# Altium project PnP.PrjPcb (part 1 of 2)
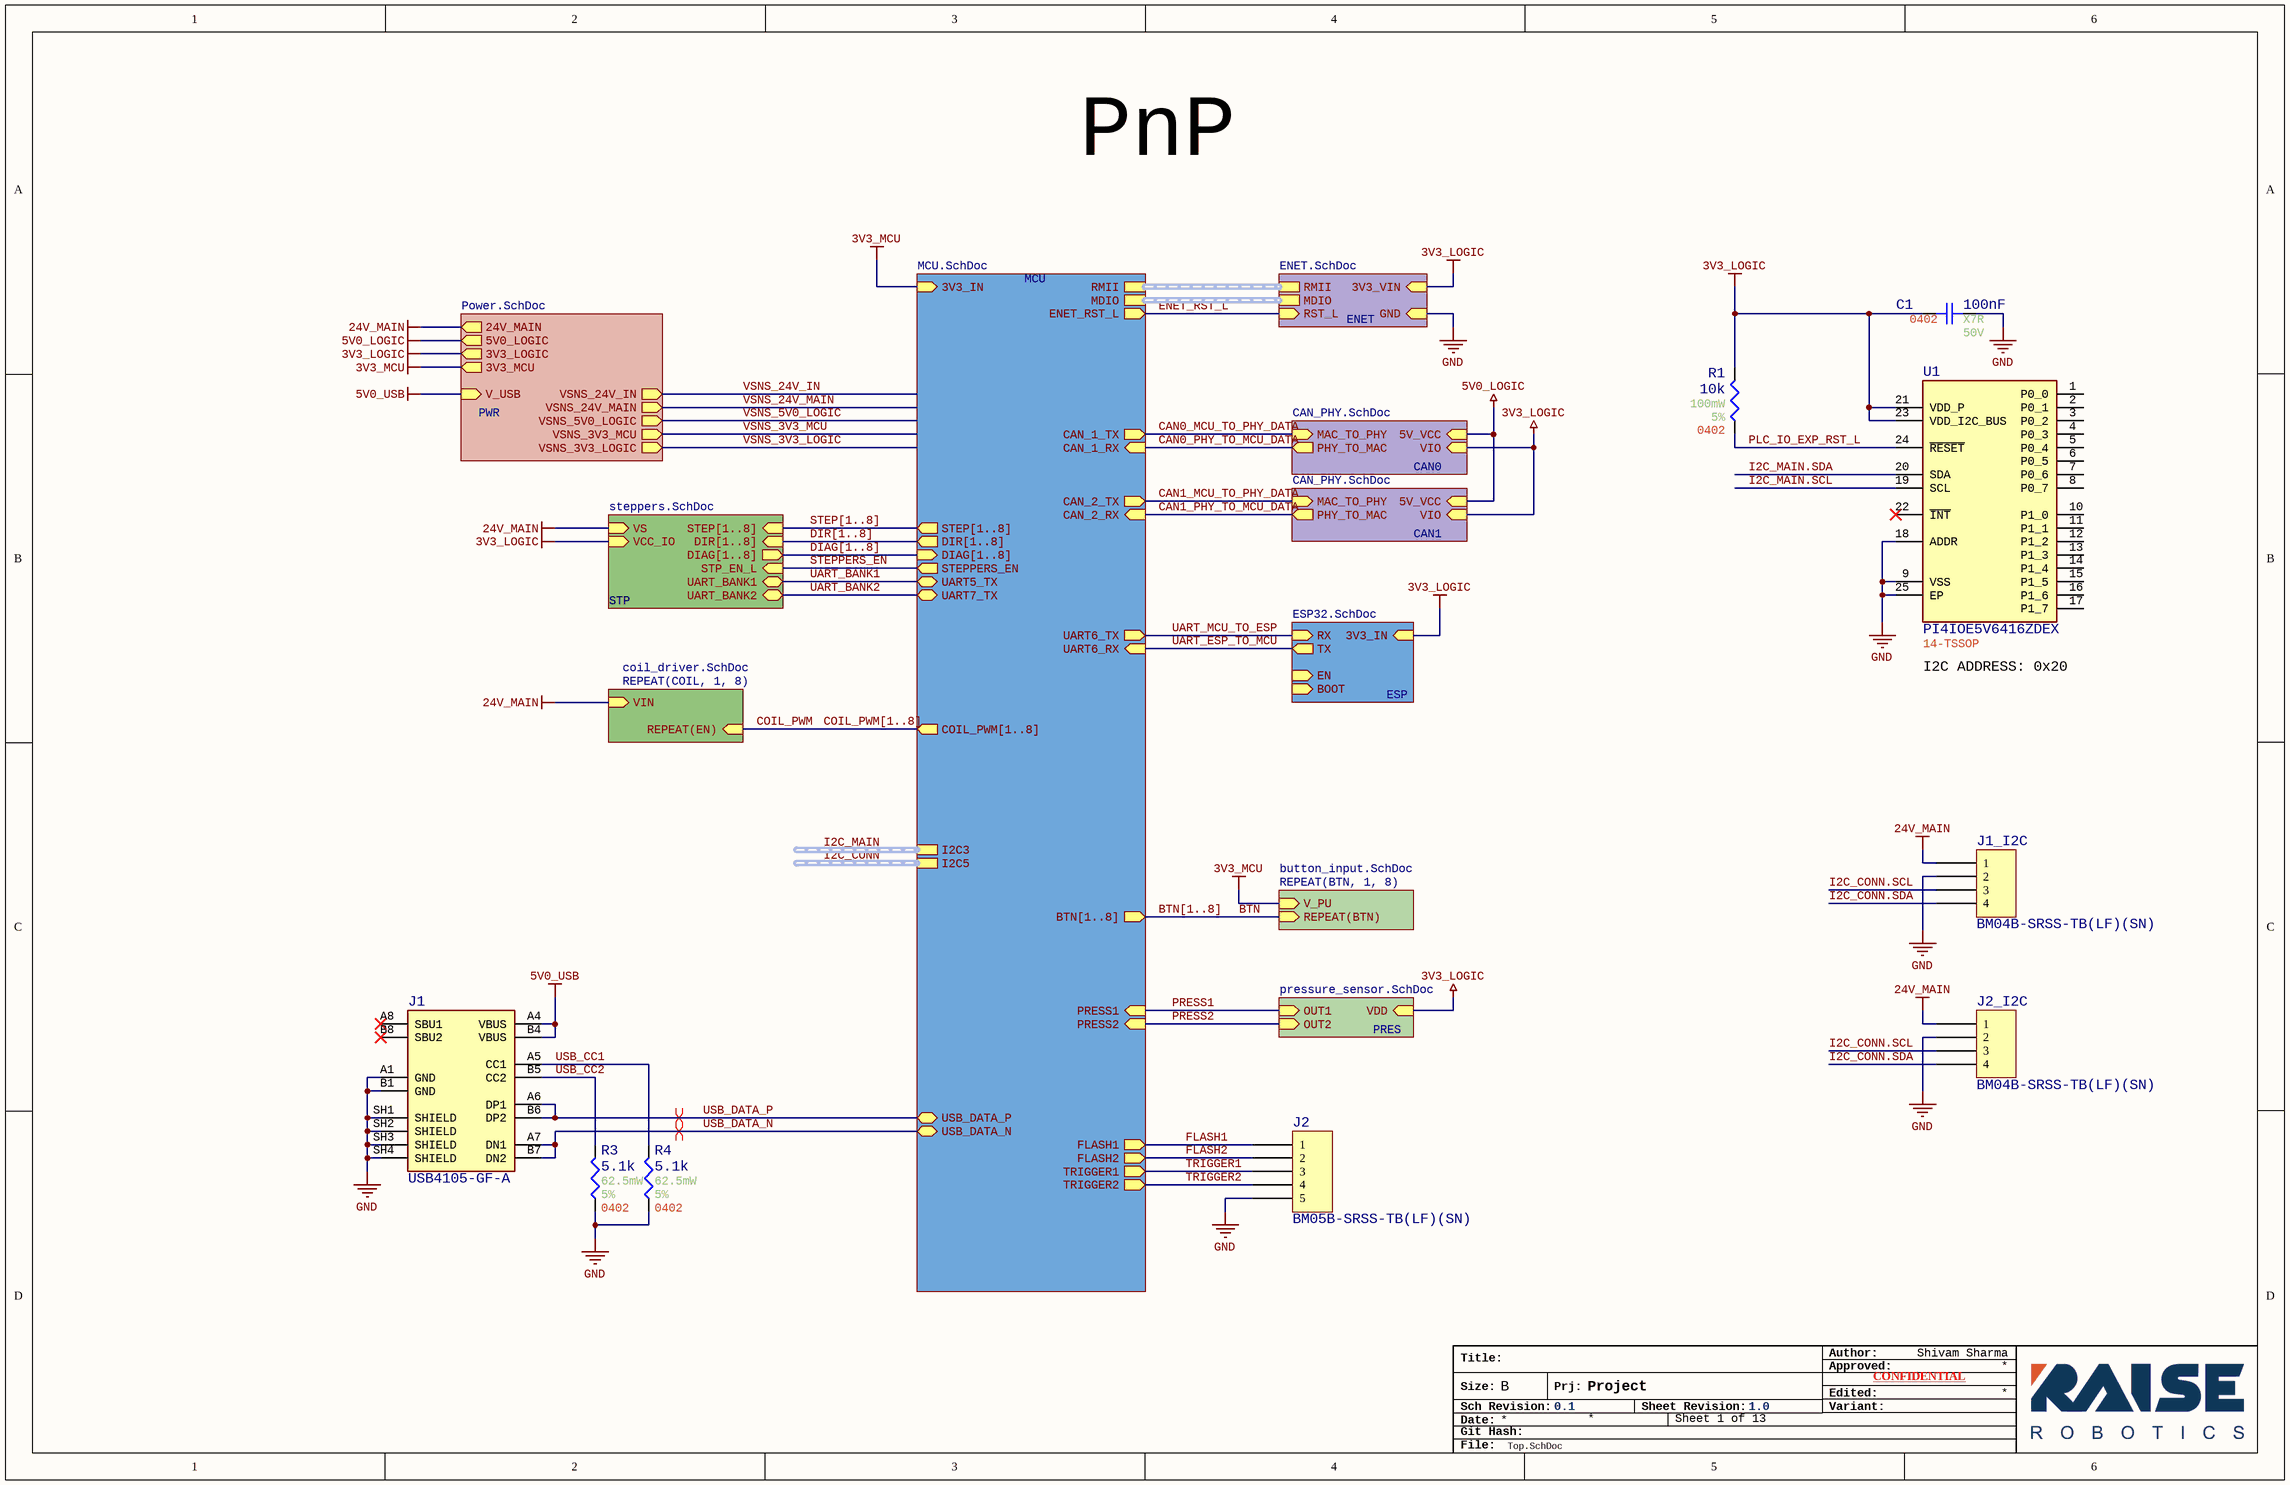
[diagram p0: Top.SchDoc]
PCBRevision: 0.0.1; ProjectTitle: Project; RR_PlaceNear: [{"paramVis":true,"a":{"refdes":"C7_MCU","srcUid":"MKZOVQBG","pin":"2"},"b":{"refdes":"U1_MCU","srcUid":"YJUBBWJW","pin":"73"},"mm":5},{"paramVis":true,"a":{"refdes":"C8_MCU","srcUid":"ILMRNPTO","pin":"2"},"b":{"refdes":"U1_MCU","srcUid":"YJUBBWJW","pin":"48"},"mm":5},{"paramVis":true,"a":{"refdes":"C13_MCU","srcUid":"YBZUFTTK","pin":"2"},"b":{"refdes":"U1_MCU","srcUid":"YJUBBWJW","pin":"100"},"mm":5},{"paramVis":true,"a":{"refdes":"C14_MCU","srcUid":"XZGWUZUA","pin":"2"},"b":{"refdes":"U1_MCU","srcUid":"YJUBBWJW","pin":"11"},"mm":5},{"paramVis":true,"a":{"refdes":"C15_MCU","srcUid":"LAALGSAD","pin":"2"},"b":{"refdes":"U1_MCU","srcUid":"YJUBBWJW","pin":"27"},"mm":5},{"paramVis":true,"a":{"refdes":"C16_MCU","srcUid":"AYAAMLSY","pin":"2"},"b":{"refdes":"U1_MCU","srcUid":"YJUBBWJW","pin":"50"},"mm":5},{"paramVis":true,"a":{"refdes":"C17_MCU","srcUid":"DWRWYZPW","pin":"2"},"b":{"refdes":"U1_MCU","srcUid":"YJUBBWJW","pin":"75"},"mm":5},{"paramVis":true,"a":{"refdes":"C18_MCU","srcUid":"ULGSEDIV","pin":"2"},"b":{"refdes":"U1_MCU","srcUid":"YJUBBWJW","pin":"21"},"mm":5},{"paramVis":true,"a":{"refdes":"C11","srcUid":"LQYWUTNS","pin":"2"},"b":{"refdes":"U3","srcUid":"LYMWEWDD","pin":"3"},"mm":5},{"paramVis":true,"a":{"refdes":"C12","srcUid":"FWSVPKWT","pin":"2"},"b":{"refdes":"U3","srcUid":"LYMWEWDD","pin":"3"},"mm":5}]; SchRevision: 0.1
11 sheets, 291 parts. Net scope: hierarchical (ports join the sheet entries above them; power ports are global).
Board file: PnP.PcbDoc
Sheets:
  Top.SchDoc
    MCU = MCU.SchDoc
    PWR = Power.SchDoc
      U_5V_Buck = 5V_Buck.SchDoc
      LDO1 = 3V3_LDO_1A.SchDoc
      LDO2 = 3V3_LDO_1A.SchDoc
    CAN0 = CAN_PHY.SchDoc
    CAN1 = CAN_PHY.SchDoc
    ENET = ENET.SchDoc
    STP = steppers.SchDoc
      STP1 = stepper_driver.SchDoc
      STP2 = stepper_driver.SchDoc
      STP3 = stepper_driver.SchDoc
      STP4 = stepper_driver.SchDoc
      STP5 = stepper_driver.SchDoc
      STP6 = stepper_driver.SchDoc
      STP7 = stepper_driver.SchDoc
      STP8 = stepper_driver.SchDoc
    PRES = pressure_sensor.SchDoc
    ESP = ESP32.SchDoc

## Sheet Top.SchDoc
size 431 x 279 mm; Author: Shivam Sharma; SheetNumber: 1; SheetTotal: 13; SheetRevision: 1.0

### Parts
C1  value 100nF  Temperature Coefficient: X7R  Voltage Rating: 50V  Case/Package: 0402  [Generic 0402 capacitor]  (hidden comment: GRT155R71H104KE01D)
J1  USB4105-GF-A  [USB-C_USB4105-GF-A]
J1_I2C  BM04B-SRSS-TB(LF)(SN)  [JST BM04B-SRSS-TB]
J2  BM05B-SRSS-TB(LF)(SN)  [JST BM05B-SRSS-TB]
J2_I2C  BM04B-SRSS-TB(LF)(SN)  [JST BM04B-SRSS-TB]
R1  value 10k  Power: 100mW  Tolerance: 5%  Case/Package: 0402  [Generic 0402 Resistor]  (hidden comment: ERJ-2GEJ103X)
R3  value 5.1k  Power: 62.5mW  Tolerance: 5%  Case/Package: 0402  [Generic 0402 Resistor]  (hidden comment: RMCF0402JT5K10)
R4  value 5.1k  Power: 62.5mW  Tolerance: 5%  Case/Package: 0402  [Generic 0402 Resistor]  (hidden comment: RMCF0402JT5K10)
U1  PI4IOE5V6416ZDEX  Case/Package: 14-TSSOP  [PI4IOE5V6416ZDEX]

### Sub-sheets
CAN0 = CAN_PHY.SchDoc: 5V_VCC (in), VIO (in), MAC_TO_PHY (in), PHY_TO_MAC (out)
CAN1 = CAN_PHY.SchDoc: 5V_VCC (in), VIO (in), MAC_TO_PHY (in), PHY_TO_MAC (out)
ENET = ENET.SchDoc: 3V3_VIN (in), GND (in), MDIO (harness MDIO), RMII (harness RMII), RST_L (in)
ESP = ESP32.SchDoc: RX (in), TX (out), EN (in), BOOT (in), 3V3_IN (in)
MCU = MCU.SchDoc: RMII (harness RMII), CAN_1_RX (in), CAN_1_TX (out), 3V3_IN (in), MDIO (harness MDIO), ENET_RST_L (out), CAN_2_RX (in), CAN_2_TX (out), STEP[1..8] (out), DIR[1..8] (out), DIAG[1..8] (in), STEPPERS_EN (out), I2C3 (harness I2C), USB_DATA_P (bidir), USB_DATA_N (bidir), COIL_PWM[1..8] (out), UART5_TX (bidir), UART7_TX (bidir), FLASH1 (out), FLASH2 (out), TRIGGER1 (out), TRIGGER2 (out), I2C5 (harness I2C), PRESS2 (in), PRESS1 (in), BTN[1..8] (out), UART6_RX (in), UART6_TX (out)
PRES = pressure_sensor.SchDoc: VDD (in), OUT1 (in), OUT2 (in)
PWR = Power.SchDoc: 24V_MAIN (out), 3V3_MCU (out), 3V3_LOGIC (out), 5V0_LOGIC (out), VSNS_24V_IN (out), VSNS_24V_MAIN (out), VSNS_5V0_LOGIC (out), VSNS_3V3_MCU (out), VSNS_3V3_LOGIC (out), V_USB (in)
REPEAT(BTN, 1, 8) = button_input.SchDoc (file not in this document): V_PU (in), REPEAT(BTN) (in)
REPEAT(COIL, 1, 8) = coil_driver.SchDoc (file not in this document): VIN (in), REPEAT(EN) (in)
STP = steppers.SchDoc: STP_EN_L (in), DIAG[1..8] (out), VS (in), VCC_IO (in), STEP[1..8] (in), DIR[1..8] (in), UART_BANK1 (bidir), UART_BANK2 (bidir)

### Nets
3V3_LOGIC: C1.2 R1.2 U1.21(VDD_P) U1.23(VDD_I2C_BUS) ; sheet PWR/3V3_LOGIC, sheet CAN0/VIO, sheet CAN1/VIO, sheet ENET/3V3_VIN, sheet STP/VCC_IO, sheet PRES/VDD, sheet ESP/3V3_IN
3V3_MCU: sheet MCU/3V3_IN, sheet PWR/3V3_MCU, sheet REPEAT(BTN, 1, 8)/V_PU
5V0_LOGIC: sheet PWR/5V0_LOGIC, sheet CAN0/5V_VCC, sheet CAN1/5V_VCC
5V0_USB: J1.A4(VBUS) J1.B4(VBUS) ; sheet PWR/V_USB
24V_MAIN: J1_I2C.1 J2_I2C.1 ; sheet PWR/24V_MAIN, sheet STP/VS, sheet REPEAT(COIL, 1, 8)/VIN
GND: C1.1 J1.A1(GND) J1.B1(GND) J1.SH1(SHIELD) J1.SH2(SHIELD) J1.SH3(SHIELD) J1.SH4(SHIELD) J1_I2C.2 J2.5 J2_I2C.2 R3.1 R4.1 U1.9(VSS) U1.18(ADDR) U1.25(EP) ; sheet ENET/GND
BTN: sheet REPEAT(BTN, 1, 8)/REPEAT(BTN)
CAN0_MCU_TO_PHY_DATA: sheet MCU/CAN_1_TX, sheet CAN0/MAC_TO_PHY
CAN0_PHY_TO_MCU_DATA: sheet MCU/CAN_1_RX, sheet CAN0/PHY_TO_MAC
CAN1_MCU_TO_PHY_DATA: sheet MCU/CAN_2_TX, sheet CAN1/MAC_TO_PHY
CAN1_PHY_TO_MCU_DATA: sheet MCU/CAN_2_RX, sheet CAN1/PHY_TO_MAC
COIL_PWM: sheet REPEAT(COIL, 1, 8)/REPEAT(EN)
ENET_RST_L: sheet MCU/ENET_RST_L, sheet ENET/RST_L
FLASH1: J2.1 ; sheet MCU/FLASH1
FLASH2: J2.2 ; sheet MCU/FLASH2
I2C_CONN.SCL: J1_I2C.3 J2_I2C.3
I2C_CONN.SDA: J1_I2C.4 J2_I2C.4
I2C_MAIN.SCL: U1.19(SCL)
I2C_MAIN.SDA: U1.20(SDA)
PLC_IO_EXP_RST_L: R1.1 U1.24(~{RESET})
PRESS1: sheet MCU/PRESS1, sheet PRES/OUT1
PRESS2: sheet MCU/PRESS2, sheet PRES/OUT2
STEPPERS_EN: sheet MCU/STEPPERS_EN, sheet STP/STP_EN_L
TRIGGER1: J2.3 ; sheet MCU/TRIGGER1
TRIGGER2: J2.4 ; sheet MCU/TRIGGER2
UART_BANK1: sheet MCU/UART5_TX, sheet STP/UART_BANK1
UART_BANK2: sheet MCU/UART7_TX, sheet STP/UART_BANK2
UART_ESP_TO_MCU: sheet MCU/UART6_RX, sheet ESP/TX
UART_MCU_TO_ESP: sheet MCU/UART6_TX, sheet ESP/RX
USB_CC1: J1.A5(CC1) R4.2
USB_CC2: J1.B5(CC2) R3.2
USB_DATA_N: J1.A7(DN1) J1.B7(DN2) ; sheet MCU/USB_DATA_N
USB_DATA_P: J1.A6(DP1) J1.B6(DP2) ; sheet MCU/USB_DATA_P

Not connected (* = marked no-connect by the designer): J1 A8(SBU1)* B8(SBU2)*; U1 1(P0_0) 2(P0_1) 3(P0_2) 4(P0_3) 5(P0_4) 6(P0_5) 7(P0_6) 8(P0_7) 10(P1_0) 11(P1_1) 12(P1_2) 13(P1_3) 14(P1_4) 15(P1_5) 16(P1_6) 17(P1_7) 22(~{INT})*

### Buses and harness runs
bus BTN[1..8] = sheet MCU/BTN[1..8]
bus COIL_PWM[1..8] = sheet MCU/COIL_PWM[1..8]
bus DIAG[1..8] = sheet MCU/DIAG[1..8] = sheet STP/DIAG[1..8]
bus DIR[1..8] = sheet MCU/DIR[1..8] = sheet STP/DIR[1..8]
bus STEP[1..8] = sheet MCU/STEP[1..8] = sheet STP/STEP[1..8]
harness I2C_CONN = sheet MCU/I2C5
harness I2C_MAIN = sheet MCU/I2C3
harness sheet ENET/MDIO = sheet MCU/MDIO
harness sheet ENET/RMII = sheet MCU/RMII

### Layout directives
differential pair; differential pair class USB: USB_DATA_N, USB_DATA_P

### Notes on the sheet
- PnP
- (near U1) I2C ADDRESS: 0x20
- Title:
- Author:
- Approved:
- Size:
- Date:
- Git Hash:
- Sch Revision:
- B
- Prj:
- Sheet Revision:
- Variant:
- Edited:
- CONFIDENTIAL
- File:

### Library data of the parts
C1 = CMP-001-00084-12: Ceramic Capacitor, Multilayer, Ceramic, 50V, 10% +Tol, 10% -Tol, X7R, 15% TC, 0.1uF, Surface Mount, 0402; AECQ: Yes; Reach SVHC Compliant: Yes; Mounting Technology: Surface Mount; Termination: Wraparound; Pins: 2; Packaging: Tape and Reel; Package Shape: Rectangular; Multilayer: Yes; Tolerance: 10%; Max Operating Temperature: 125°C; Terminal Finish: Nickel; Capacitor Type: Ceramic; Dielectric Material: Ceramic; Min Operating Temperature: -55°C; RoHS Compliant: Yes
J1 = CMP-002-00138-1: USB Connector, 24 Contact(s), Female, Right Angle, Solder Terminal, Locking, Receptacle; Manufacturer: Molex; Connector Type: USB-C; Max Current Rating: 5A; Voltage Rating: 20V; Case/Package: TH USB-C; Height: 3.46mm; Pins: 16; Max Operating Temperature: 85°C; Gender: Female; Min Operating Temperature: -40°C
J1_I2C J2_I2C = BM04B-SRSS-TB(LF)(SN): CONN HEADER SMD 4POS 1MM; Manufacturer: JST Sales America Inc.; Current Rating (Amps): 0.7A; Material Flammability Rating: UL94 V-0; Number of Positions: 4; Number of Positions Loaded: All; Pitch - Mating: 0.039" (1.00mm); Row Spacing - Mating: -25°C ~ 85°C; Shrouding: Shrouded - 4 Wall; Style: Board to Cable/Wire; Voltage Rating: 50V; Part Number: BM04B-SRSS-TB(LF)(SN); ComponentLink1Description: Datasheet; ComponentLink1URL: http://www.jst-mfg.com/product/pdf/eng/eSH.pdf; ComponentLink2Description: DigiKey Link; ComponentLink2URL: http://digikey.com/product-detail/en/jst-sales-america-inc/BM04B-SRSS-TB-LF-SN/455-1790-1-ND/926861; Connector Type: Header; Contact Finish - Mating: Tin; Contact Finish - Post: Tin; Contact Material: Copper Alloy; Contact Shape: Square; Contact Type: Male Pin; Fastening Type: Push-Pull; Features: Solder Retention; Insulation Color: Natural; Insulation Height: 0.167" (4.25mm); Insulation Material: Polyamide (PA), Nylon; LastUpdated: 8/24/2020 1:45:53 PM; Lifecycle Status: Active; Minimum Order: 1; Mounting Type: Surface Mount; Number of Rows: 1; Operating Temperature: -25°C ~ 85°C; Packaging: TapeAndReel; PartId: 16; Part Status: Active; Price: 0.29; Series: SR; Supplier 1: DigiKey; Supplier Part Number 1: 455-1790-1-ND; Termination: Solder
J2 = BM05B-SRSS-TB(LF)(SN): CONN HEADER SMD 5POS 1MM; Manufacturer: JST Sales America Inc.; Current Rating (Amps): 0.7A; Material Flammability Rating: UL94 V-0; Number of Positions: 5; Number of Positions Loaded: All; Pitch - Mating: 0.039" (1.00mm); Shrouding: Shrouded - 4 Wall; Style: Board to Cable/Wire; Voltage Rating: 50V; Part Number: BM05B-SRSS-TB(LF)(SN); ComponentLink1Description: Datasheet; ComponentLink1URL: http://www.jst-mfg.com/product/pdf/eng/eSR.pdf; ComponentLink2Description: DigiKey Link; ComponentLink2URL: http://digikey.com/product-detail/en/jst-sales-america-inc/BM05B-SRSS-TB-LF-SN/455-1791-1-ND/926862; Connector Type: Header; Contact Finish - Mating: Tin; Contact Finish - Post: Tin; Contact Material: Copper Alloy; Contact Shape: Square; Contact Type: Male Pin; Fastening Type: Push-Pull; Features: Solder Retention; Insulation Color: Natural; Insulation Height: 0.167" (4.25mm); Insulation Material: Polyamide (PA), Nylon; LastUpdated: 1/12/2020 10:14:00 PM; Lifecycle Status: Active; Minimum Order: 1; Mounting Type: Surface Mount; Number of Rows: 1; Operating Temperature: -25°C ~ 85°C; Packaging: TapeAndReel; PartId: 18; Part Status: Active; Price: 0.35; Series: SR; Supplier 1: DigiKey; Supplier Part Number 1: 455-1791-1-ND; Termination: Solder
R1 = CMP-009-00185-9: Res Thick Film 0402 10K Ohm 5% 1/10W ±200ppm/°C Molded SMD Punched Carrier T/R; AECQ: No; Pins: 2; Max Operating Temperature: 155°C; RoHS Compliant: Yes; Min Operating Temperature: -55°C; Mounting Technology: Surface Mount
R3 R4 = CMP-009-00220-1: Res Thick Film 0402 5.1K Ohm 5% 0.063W ±100ppm/°C Molded SMD Paper T/R; AECQ: Yes; Max Operating Temperature: 155°C; Pins: 2; Mounting Technology: Surface Mount; RoHS Compliant: Yes; Min Operating Temperature: -55°C
U1 = CMP-031-00013-2: 16-bit I2C General Purpose IO Expander with Interrupt, Reset, -40 to 85 °C, RoHS; Number of Circuits: 1; AECQ: No; Min Supply Voltage: 1.65V; Max Supply Voltage: 5.5V; Number of Terminals: 24; Schedule B: 8542390000, 8542390000; Pins: 14; RoHS: Compliant; Max Operating Temperature: 85°C; Lifecycle Status: Production; Terminal Pitch: 500µm; Width: 4mm; Min Operating Temperature: -40°C; REACH SVHC: Yes; Length: 4mm; Height - Seated (Max): 900µm; MPN: PI4IOE5V6416ZDEX

## Sheet MCU.SchDoc
size 431 x 279 mm; Author: Shivam Sharma; SheetNumber: 2; SheetTotal: 13
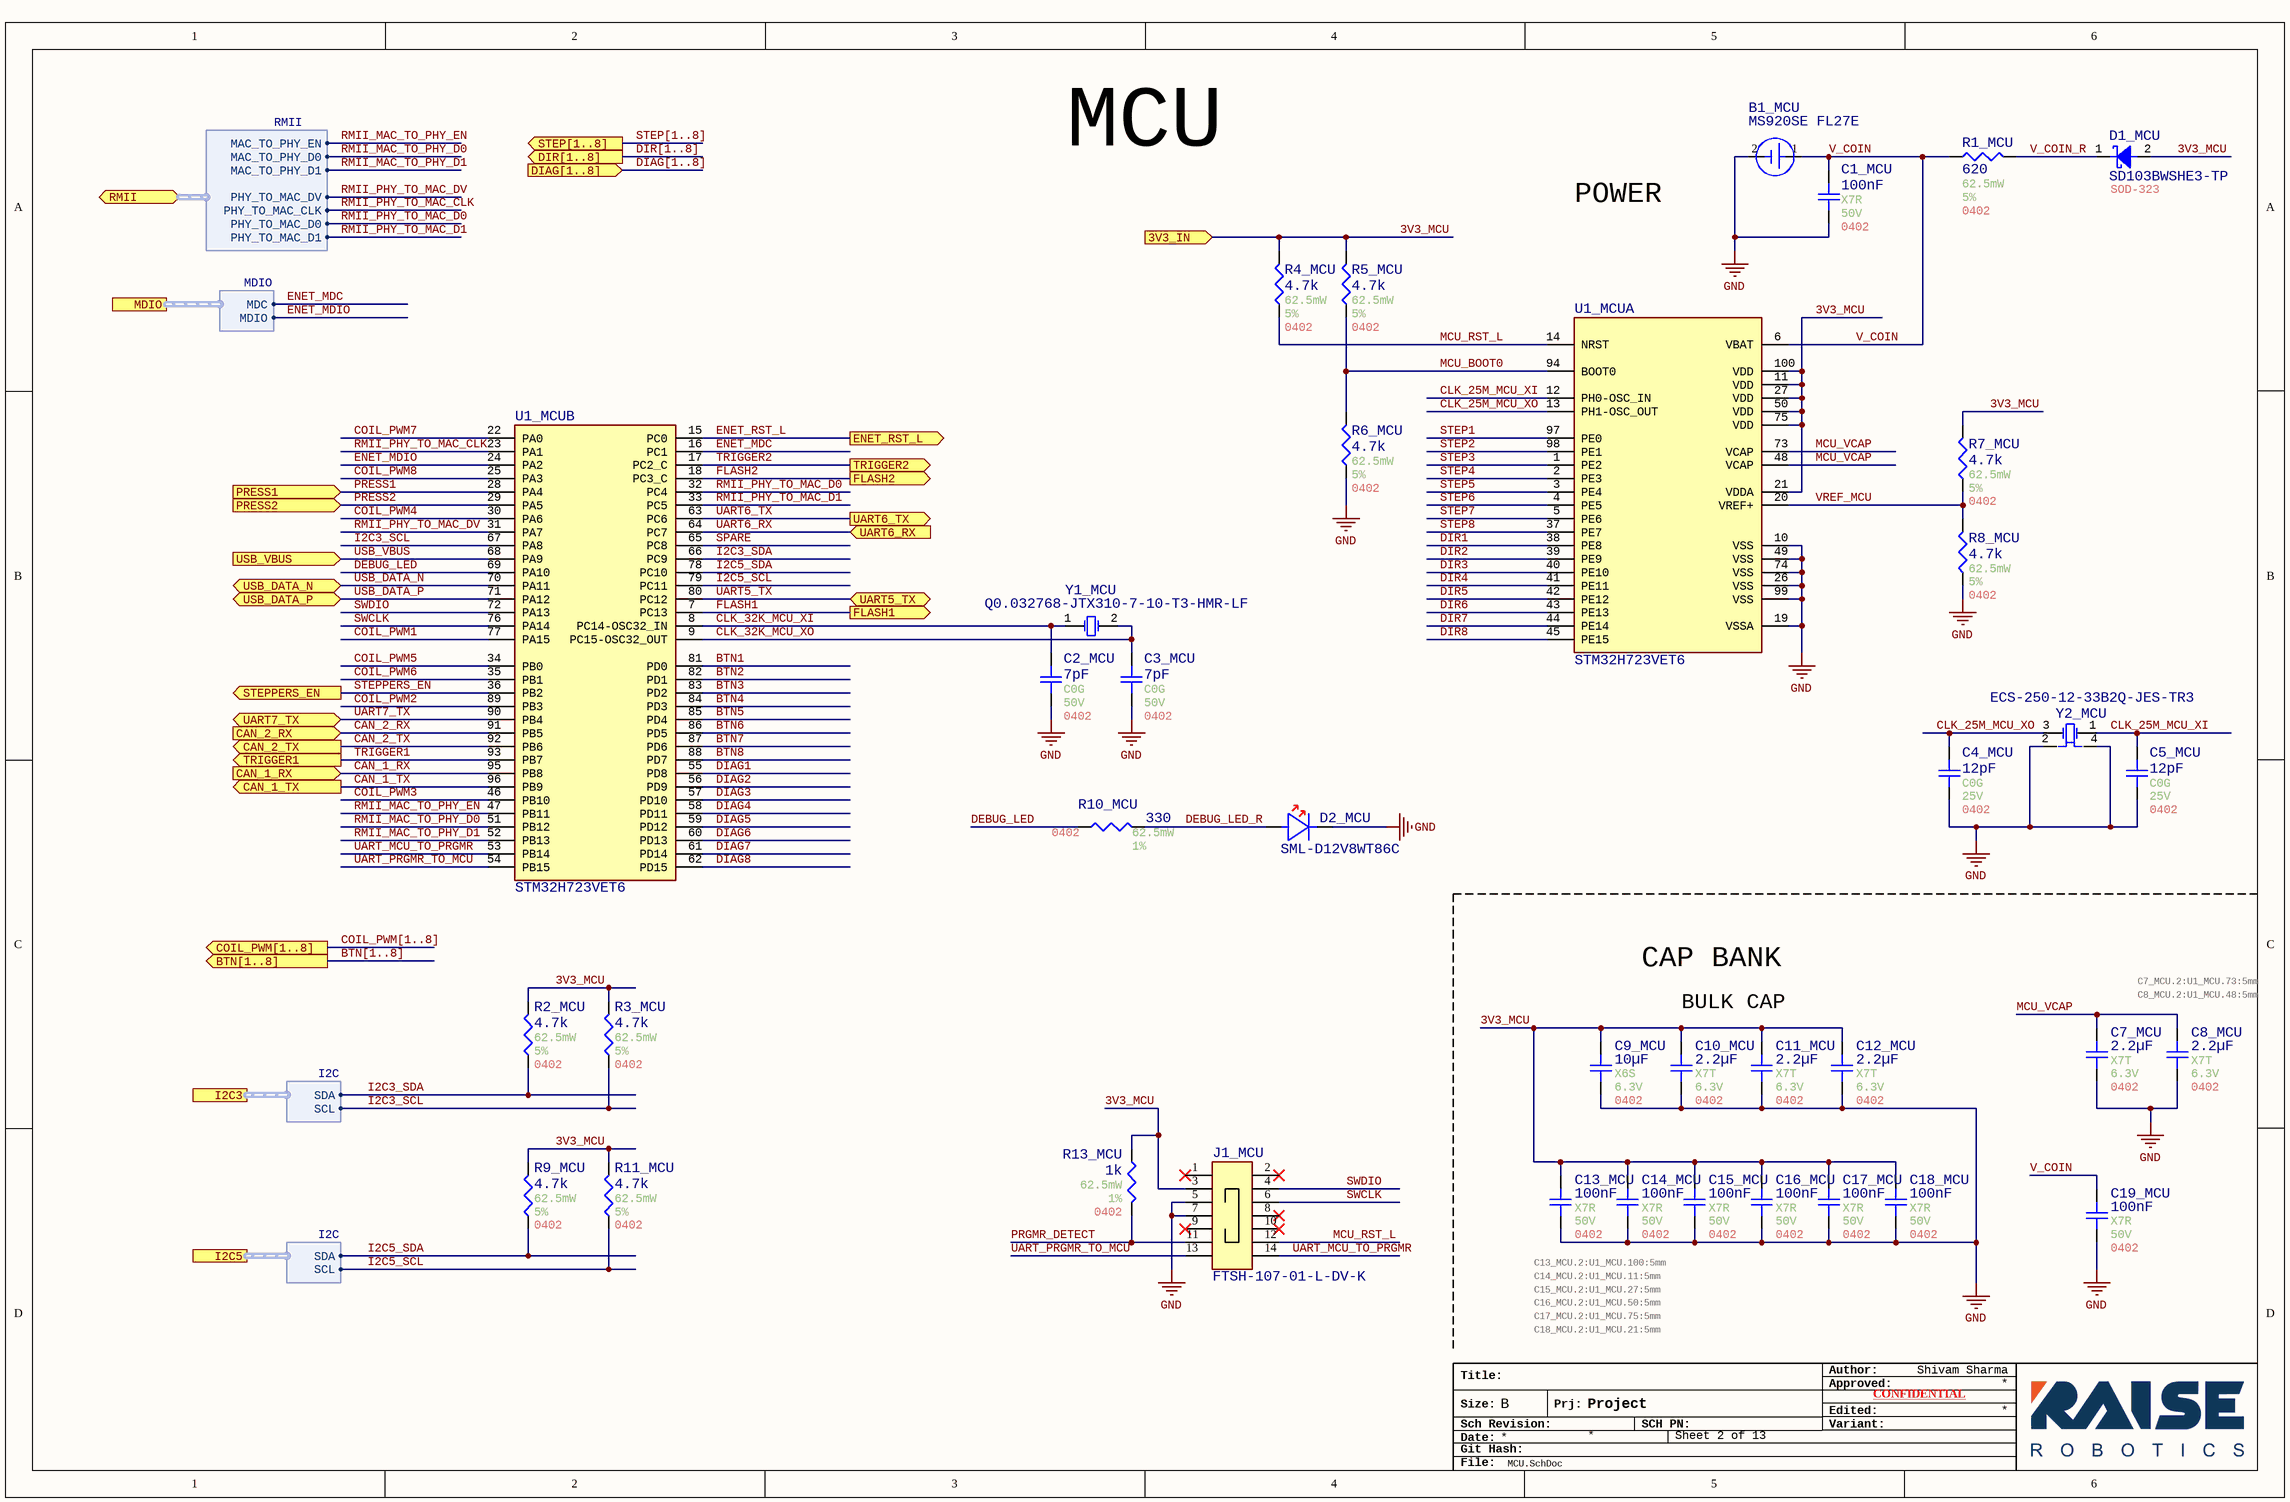
[diagram p1: MCU.SchDoc]

### Parts
B1_MCU  MS920SE FL27E  [MS920SE-FL27E]
C1_MCU  value 100nF  Temperature Coefficient: X7R  Voltage Rating: 50V  Case/Package: 0402  [Generic 0402 capacitor]  (hidden comment: GRT155R71H104KE01D)
C2_MCU  value 7pF  Temperature Coefficient: C0G  Voltage Rating: 50V  Case/Package: 0402  [Generic 0402 capacitor]  (hidden comment: GCM1555C1H7R0CA16J)
C3_MCU  value 7pF  Temperature Coefficient: C0G  Voltage Rating: 50V  Case/Package: 0402  [Generic 0402 capacitor]  (hidden comment: GCM1555C1H7R0CA16J)
C4_MCU  value 12pF  Temperature Coefficient: C0G  Voltage Rating: 25V  Case/Package: 0402  [Generic 0402 capacitor]  (hidden comment: GRT1555C1E120JA02J)
C5_MCU  value 12pF  Temperature Coefficient: C0G  Voltage Rating: 25V  Case/Package: 0402  [Generic 0402 capacitor]  (hidden comment: GRT1555C1E120JA02J)
C7_MCU  value 2.2µF  Temperature Coefficient: X7T  Voltage Rating: 6.3V  Case/Package: 0402  PlaceNear: C7_MCU.2:U1_MCU.73:5mm  [Generic 0402 capacitor]  (hidden comment: MAASJ105CD7225MFCA01)
C8_MCU  value 2.2µF  Temperature Coefficient: X7T  Voltage Rating: 6.3V  Case/Package: 0402  PlaceNear: C8_MCU.2:U1_MCU.48:5mm  [Generic 0402 capacitor]  (hidden comment: MAASJ105CD7225MFCA01)
C9_MCU  value 10µF  Temperature Coefficient: X6S  Voltage Rating: 6.3V  Case/Package: 0402  [Generic 0402 capacitor]  (hidden comment: GRT155C80J106ME13J)
C10_MCU  value 2.2µF  Temperature Coefficient: X7T  Voltage Rating: 6.3V  Case/Package: 0402  [Generic 0402 capacitor]  (hidden comment: MAASJ105CD7225MFCA01)
C11_MCU  value 2.2µF  Temperature Coefficient: X7T  Voltage Rating: 6.3V  Case/Package: 0402  [Generic 0402 capacitor]  (hidden comment: MAASJ105CD7225MFCA01)
C12_MCU  value 2.2µF  Temperature Coefficient: X7T  Voltage Rating: 6.3V  Case/Package: 0402  [Generic 0402 capacitor]  (hidden comment: MAASJ105CD7225MFCA01)
C13_MCU  value 100nF  Temperature Coefficient: X7R  Voltage Rating: 50V  Case/Package: 0402  PlaceNear: C13_MCU.2:U1_MCU.100:5mm  [Generic 0402 capacitor]  (hidden comment: GRT155R71H104KE01D)
C14_MCU  value 100nF  Temperature Coefficient: X7R  Voltage Rating: 50V  Case/Package: 0402  PlaceNear: C14_MCU.2:U1_MCU.11:5mm  [Generic 0402 capacitor]  (hidden comment: GRT155R71H104KE01D)
C15_MCU  value 100nF  Temperature Coefficient: X7R  Voltage Rating: 50V  Case/Package: 0402  PlaceNear: C15_MCU.2:U1_MCU.27:5mm  [Generic 0402 capacitor]  (hidden comment: GRT155R71H104KE01D)
C16_MCU  value 100nF  Temperature Coefficient: X7R  Voltage Rating: 50V  Case/Package: 0402  PlaceNear: C16_MCU.2:U1_MCU.50:5mm  [Generic 0402 capacitor]  (hidden comment: GRT155R71H104KE01D)
C17_MCU  value 100nF  Temperature Coefficient: X7R  Voltage Rating: 50V  Case/Package: 0402  PlaceNear: C17_MCU.2:U1_MCU.75:5mm  [Generic 0402 capacitor]  (hidden comment: GRT155R71H104KE01D)
C18_MCU  value 100nF  Temperature Coefficient: X7R  Voltage Rating: 50V  Case/Package: 0402  PlaceNear: C18_MCU.2:U1_MCU.21:5mm  [Generic 0402 capacitor]  (hidden comment: GRT155R71H104KE01D)
C19_MCU  value 100nF  Temperature Coefficient: X7R  Voltage Rating: 50V  Case/Package: 0402  [Generic 0402 capacitor]  (hidden comment: GRT155R71H104KE01D)
D1_MCU  SD103BWSHE3-TP  [SOD-323]
D2_MCU  SML-D12V8WT86C  [FP-SML-D12-MFG]
J1_MCU  FTSH-107-01-L-DV-K  [FTSH-107-01-L-DV-K-TR]
R1_MCU  value 620  Power: 62.5mW  Tolerance: 5%  Case/Package: 0402  [Generic 0402 Resistor]  (hidden comment: RC0402JR-07620RL)
R2_MCU  value 4.7k  Power: 62.5mW  Tolerance: 5%  Case/Package: 0402  [Generic 0402 Resistor]  (hidden comment: WR04X472JTL)
R3_MCU  value 4.7k  Power: 62.5mW  Tolerance: 5%  Case/Package: 0402  [Generic 0402 Resistor]  (hidden comment: WR04X472JTL)
R4_MCU  value 4.7k  Power: 62.5mW  Tolerance: 5%  Case/Package: 0402  [Generic 0402 Resistor]  (hidden comment: WR04X472JTL)
R5_MCU  value 4.7k  Power: 62.5mW  Tolerance: 5%  Case/Package: 0402  [Generic 0402 Resistor]  (hidden comment: WR04X472JTL)
R6_MCU  value 4.7k  Power: 62.5mW  Tolerance: 5%  Case/Package: 0402  [Generic 0402 Resistor]  (hidden comment: WR04X472JTL)
R7_MCU  value 4.7k  Power: 62.5mW  Tolerance: 5%  Case/Package: 0402  [Generic 0402 Resistor]  (hidden comment: WR04X472JTL)
R8_MCU  value 4.7k  Power: 62.5mW  Tolerance: 5%  Case/Package: 0402  [Generic 0402 Resistor]  (hidden comment: WR04X472JTL)
R9_MCU  value 4.7k  Power: 62.5mW  Tolerance: 5%  Case/Package: 0402  [Generic 0402 Resistor]  (hidden comment: WR04X472JTL)
R10_MCU  value 330  Power: 62.5mW  Tolerance: 1%  Case/Package: 0402  [Generic 0402 Resistor]  (hidden comment: RMCF0402FT330R)
R11_MCU  value 4.7k  Power: 62.5mW  Tolerance: 5%  Case/Package: 0402  [Generic 0402 Resistor]  (hidden comment: WR04X472JTL)
R13_MCU  value 1k  Power: 62.5mW  Tolerance: 1%  Case/Package: 0402  [Generic 0402 Resistor]  (hidden comment: WR04X1001FTL)
U1_MCU  STM32H723VET6  [STM32H723VxT]  (parts A,B of 2)
Y1_MCU  Q0.032768-JTX310-7-10-T3-HMR-LF  [JTX310]
Y2_MCU  ECS-250-12-33B2Q-JES-TR3  [ECS-250-12-33B2Q-JES-TR3]

### Ports
3V3_IN (in), BTN[1..8] (out), CAN_1_RX (in), CAN_1_TX (out), CAN_2_RX (in), CAN_2_TX (out), COIL_PWM[1..8] (out), DIAG[1..8] (in), DIR[1..8] (out), ENET_RST_L (out), FLASH1 (out), FLASH2 (out), I2C3 (harness I2C), I2C5 (harness I2C), MDIO (harness MDIO), PRESS1 (in), PRESS2 (in), RMII (bidir, harness RMII), STEP[1..8] (out), STEPPERS_EN (out), TRIGGER1 (out), TRIGGER2 (out), UART5_TX (bidir), UART6_RX (in), UART6_TX (out), UART7_TX (bidir), USB_DATA_N (bidir), USB_DATA_P (bidir), USB_VBUS (in)

### Harnesses
RMII: MAC_TO_PHY_D0, MAC_TO_PHY_D1, PHY_TO_MAC_D0, PHY_TO_MAC_CLK, PHY_TO_MAC_D1, MAC_TO_PHY_EN, PHY_TO_MAC_DV
MDIO: MDIO, MDC
I2C: SDA, SCL

### Nets
3V3_MCU: C9_MCU.2 C10_MCU.2 C11_MCU.2 C12_MCU.2 C13_MCU.2 C14_MCU.2 C15_MCU.2 C16_MCU.2 C17_MCU.2 C18_MCU.2 D1_MCU.2(A) J1_MCU.3 R2_MCU.2 R3_MCU.2 R4_MCU.2 R5_MCU.2 R7_MCU.2 R9_MCU.2 R11_MCU.2 R13_MCU.2 U1_MCU.11(VDD) U1_MCU.21(VDDA) U1_MCU.27(VDD) U1_MCU.50(VDD) U1_MCU.75(VDD) U1_MCU.100(VDD) ; port 3V3_IN
GND: B1_MCU.2 C1_MCU.1 C2_MCU.1 C3_MCU.1 C4_MCU.1 C5_MCU.1 C7_MCU.1 C8_MCU.1 C9_MCU.1 C10_MCU.1 C11_MCU.1 C12_MCU.1 C13_MCU.1 C14_MCU.1 C15_MCU.1 C16_MCU.1 C17_MCU.1 C18_MCU.1 C19_MCU.1 D2_MCU.1(C) J1_MCU.5 J1_MCU.7 R6_MCU.1 R8_MCU.1 U1_MCU.10(VSS) U1_MCU.19(VSSA) U1_MCU.26(VSS) U1_MCU.49(VSS) U1_MCU.74(VSS) U1_MCU.99(VSS) Y2_MCU.2 Y2_MCU.4
BTN1: U1_MCU.81(PD0)
BTN2: U1_MCU.82(PD1)
BTN3: U1_MCU.83(PD2)
BTN4: U1_MCU.84(PD3)
BTN5: U1_MCU.85(PD4)
BTN6: U1_MCU.86(PD5)
BTN7: U1_MCU.87(PD6)
BTN8: U1_MCU.88(PD7)
CAN_1_RX: U1_MCU.95(PB8) ; port CAN_1_RX  [project net CAN0_PHY_TO_MCU_DATA]
CAN_1_TX: U1_MCU.96(PB9) ; port CAN_1_TX  [project net CAN0_MCU_TO_PHY_DATA]
CAN_2_RX: U1_MCU.91(PB5) ; port CAN_2_RX  [project net CAN1_PHY_TO_MCU_DATA]
CAN_2_TX: U1_MCU.92(PB6) ; port CAN_2_TX  [project net CAN1_MCU_TO_PHY_DATA]
CLK_25M_MCU_XI: C5_MCU.2 U1_MCU.12(PH0-OSC_IN) Y2_MCU.1
CLK_25M_MCU_XO: C4_MCU.2 U1_MCU.13(PH1-OSC_OUT) Y2_MCU.3
CLK_32K_MCU_XI: C2_MCU.2 U1_MCU.8(PC14-OSC32_IN) Y1_MCU.1
CLK_32K_MCU_XO: C3_MCU.2 U1_MCU.9(PC15-OSC32_OUT) Y1_MCU.2
COIL_PWM1: U1_MCU.77(PA15)
COIL_PWM2: U1_MCU.89(PB3)
COIL_PWM3: U1_MCU.46(PB10)
COIL_PWM4: U1_MCU.30(PA6)
COIL_PWM5: U1_MCU.34(PB0)
COIL_PWM6: U1_MCU.35(PB1)
COIL_PWM7: U1_MCU.22(PA0)
COIL_PWM8: U1_MCU.25(PA3)
DEBUG_LED: R10_MCU.1 U1_MCU.69(PA10)
DEBUG_LED_R: D2_MCU.2(A) R10_MCU.2
DIAG1: U1_MCU.55(PD8)
DIAG2: U1_MCU.56(PD9)
DIAG3: U1_MCU.57(PD10)
DIAG4: U1_MCU.58(PD11)
DIAG5: U1_MCU.59(PD12)
DIAG6: U1_MCU.60(PD13)
DIAG7: U1_MCU.61(PD14)
DIAG8: U1_MCU.62(PD15)
DIR1: U1_MCU.38(PE8)
DIR2: U1_MCU.39(PE9)
DIR3: U1_MCU.40(PE10)
DIR4: U1_MCU.41(PE11)
DIR5: U1_MCU.42(PE12)
DIR6: U1_MCU.43(PE13)
DIR7: U1_MCU.44(PE14)
DIR8: U1_MCU.45(PE15)
ENET_MDC: U1_MCU.16(PC1) ; port MDIO.MDC
ENET_MDIO: U1_MCU.24(PA2) ; port MDIO.MDIO
ENET_RST_L: U1_MCU.15(PC0) ; port ENET_RST_L
FLASH1: U1_MCU.7(PC13) ; port FLASH1
FLASH2: U1_MCU.18(PC3_C) ; port FLASH2
I2C3_SCL: R3_MCU.1 U1_MCU.67(PA8) ; port I2C3.SCL  [project net I2C_MAIN.SCL]
I2C3_SDA: R2_MCU.1 U1_MCU.66(PC9) ; port I2C3.SDA  [project net I2C_MAIN.SDA]
I2C5_SCL: R11_MCU.1 U1_MCU.79(PC11) ; port I2C5.SCL  [project net I2C_CONN.SCL]
I2C5_SDA: R9_MCU.1 U1_MCU.78(PC10) ; port I2C5.SDA  [project net I2C_CONN.SDA]
MCU_BOOT0: R5_MCU.1 R6_MCU.2 U1_MCU.94(BOOT0)
MCU_RST_L: J1_MCU.12 R4_MCU.1 U1_MCU.14(NRST)
MCU_VCAP: C7_MCU.2 C8_MCU.2 U1_MCU.48(VCAP) U1_MCU.73(VCAP)
PRESS1: U1_MCU.28(PA4) ; port PRESS1
PRESS2: U1_MCU.29(PA5) ; port PRESS2
PRGMR_DETECT: J1_MCU.11 R13_MCU.1
RMII_MAC_TO_PHY_D0: U1_MCU.51(PB12) ; port RMII.MAC_TO_PHY_D0
RMII_MAC_TO_PHY_D1: U1_MCU.52(PB13) ; port RMII.MAC_TO_PHY_D1
RMII_MAC_TO_PHY_EN: U1_MCU.47(PB11) ; port RMII.MAC_TO_PHY_EN
RMII_PHY_TO_MAC_CLK: U1_MCU.23(PA1) ; port RMII.PHY_TO_MAC_CLK
RMII_PHY_TO_MAC_D0: U1_MCU.32(PC4) ; port RMII.PHY_TO_MAC_D0
RMII_PHY_TO_MAC_D1: U1_MCU.33(PC5) ; port RMII.PHY_TO_MAC_D1
RMII_PHY_TO_MAC_DV: U1_MCU.31(PA7) ; port RMII.PHY_TO_MAC_DV
SPARE: U1_MCU.65(PC8)
STEP1: U1_MCU.97(PE0)
STEP2: U1_MCU.98(PE1)
STEP3: U1_MCU.1(PE2)
STEP4: U1_MCU.2(PE3)
STEP5: U1_MCU.3(PE4)
STEP6: U1_MCU.4(PE5)
STEP7: U1_MCU.5(PE6)
STEP8: U1_MCU.37(PE7)
STEPPERS_EN: U1_MCU.36(PB2) ; port STEPPERS_EN
SWCLK: J1_MCU.6 U1_MCU.76(PA14)
SWDIO: J1_MCU.4 U1_MCU.72(PA13)
TRIGGER1: U1_MCU.93(PB7) ; port TRIGGER1
TRIGGER2: U1_MCU.17(PC2_C) ; port TRIGGER2
UART5_TX: U1_MCU.80(PC12) ; port UART5_TX  [project net UART_BANK1]
UART6_RX: U1_MCU.64(PC7) ; port UART6_RX  [project net UART_ESP_TO_MCU]
UART6_TX: U1_MCU.63(PC6) ; port UART6_TX  [project net UART_MCU_TO_ESP]
UART7_TX: U1_MCU.90(PB4) ; port UART7_TX  [project net UART_BANK2]
UART_MCU_TO_PRGMR: J1_MCU.14 U1_MCU.53(PB14)
UART_PRGMR_TO_MCU: J1_MCU.13 U1_MCU.54(PB15)
USB_DATA_N: U1_MCU.70(PA11) ; port USB_DATA_N
USB_DATA_P: U1_MCU.71(PA12) ; port USB_DATA_P
USB_VBUS: U1_MCU.68(PA9) ; port USB_VBUS
V_COIN: B1_MCU.1 C1_MCU.2 C19_MCU.2 R1_MCU.1 U1_MCU.6(VBAT)
V_COIN_R: D1_MCU.1(C) R1_MCU.2
VREF_MCU: R7_MCU.1 R8_MCU.2 U1_MCU.20(VREF+)

Not connected (* = marked no-connect by the designer): J1_MCU 1* 2* 8* 9* 10*

### Buses and harness runs
bus BTN[1..8] = port BTN[1..8]
bus COIL_PWM[1..8] = port COIL_PWM[1..8]
bus DIAG[1..8] = port DIAG[1..8]
bus DIR[1..8] = port DIR[1..8]
bus STEP[1..8] = port STEP[1..8]

### Notes on the sheet
- MCU
- POWER
- CAP BANK
- BULK CAP
- Title:
- Author:
- Approved:
- Size:
- Date:
- Git Hash:
- Sch Revision:
- B
- Prj:
- SCH PN:
- Variant:
- Edited:
- CONFIDENTIAL
- File:

### Library data of the parts
B1_MCU = CMP-00029-00001-1: Secondary Battery, Manganese Silicon Lithium, 3V, 0.011Ah; Pins: 2; RoHS Compliant: Yes; Voltage Rating: 3V
C1_MCU C13_MCU C14_MCU C15_MCU C16_MCU C17_MCU C18_MCU C19_MCU = CMP-001-00084-12: as C1 on sheet Top; Reach SVHC Compliant: Yes; Mounting Technology: Surface Mount; Termination: Wraparound; Pins: 2; Packaging: Tape and Reel; Package Shape: Rectangular; Multilayer: Yes; Tolerance: 10%; Max Operating Temperature: 125°C; Terminal Finish: Nickel; Capacitor Type: Ceramic; Dielectric Material: Ceramic; Min Operating Temperature: -55°C; RoHS Compliant: Yes
C2_MCU C3_MCU = CMP-001-00111-2: Ceramic Capacitor, Multilayer, Ceramic, 50V, 3.57% +Tol, 3.57% -Tol, C0G, 30ppm/Cel TC, 0.000007uF, Surface Mount, 0402; AECQ: Yes; Tolerance: 3.5%; Mounting Technology: Surface Mount; Pins: 2; Min Operating Temperature: -55°C; Max Operating Temperature: 125°C; Capacitor Type: Ceramic; RoHS Compliant: Yes
C4_MCU C5_MCU = CMP-001-00109-2: Ceramic Capacitor, Multilayer, Ceramic, 25V, 5% +Tol, 5% -Tol, C0G, 30ppm/Cel TC, 0.000012uF, Surface Mount, 0402; AECQ: Yes; Pins: 2; Mounting Technology: Surface Mount; Min Operating Temperature: -55°C; RoHS Compliant: Yes; Max Operating Temperature: 125°C; Tolerance: 5%; Capacitor Type: Ceramic
C7_MCU C8_MCU C10_MCU C11_MCU C12_MCU = CMP-001-00096-4: Mlcc, 2.2 Uf, # 20 %, 0402, 6.3V, X7T, T&r Q200; Tolerance: 20%; Capacitor Type: Ceramic; AECQ: Yes; Mounting Technology: SMD; Pins: 2; Max Operating Temperature: 125°C; Min Operating Temperature: -55°C
C9_MCU = CMP-001-00108-2: Multilayer Ceramic Capacitors MLCC - SMD/SMT 0402 10uF 6.3VDC 20% X6S AEC-Q200; AECQ: Yes; Mounting Technology: Surface Mount; Max Operating Temperature: 105°C; Min Operating Temperature: -55°C; Tolerance: 20%; Pins: 2; RoHS Compliant: Yes; Capacitor Type: Ceramic
D1_MCU = CMP-004-00038-1: Rectifier Diode, Schottky, 1 Phase, 1 Element, 0.35A, 30V V(RRM), Silicon; Reverse Recovery Time: 10ns; Forward Voltage: 370mV; Forward Current: 350mA; Min Operating Temperature: -55°C; Max Operating Temperature: 125°C; RoHS Compliant: Yes; Min Breakdown Voltage: 30V; Max Output current: 350mA; Case/Package: SOD-323; Pins: 2
D2_MCU = CMP-007-00036-1: Red 630nm LED Indication - Discrete 2.2V 0603 (1608 Metric); Case/Package: 0603; Forward Voltage: 2.2V; Colour: Red; Pins: 2
J1_MCU = CMP-002-00103-1: Board Connector, 14 Contact(s), 2 Row(s), Male, Straight, 0.05 inch Pitch, Surface Mount Terminal, Locking, Receptacle; Manufacturer: Samtec; Manufacturer Series: FTSH; Filter Feature: No; Number of Contacts: 14; Plating Thickness: 10uin; Number Of Connectors: 1; Contact Pattern: RECTANGULAR; Body Length: 0.35inch; Mating Information: MULTIPLE MATING PARTS AVAILABLE; PCB Contact Row Spacing: 4.064mm; Reference Standard: UL; Number Of PCB Rows: 2; Option: General Purpose; Body Breadth: 0.135inch; Max Current Rating: 3.4A; Reliability: COMMERCIAL; Contact Style: SQ PIN-SKT; Body/Shell Style: RECEPTACLE; Mounting Style: STRAIGHT; Contact Material: Bronze; Terminal Pitch: 1.27mm; Termination: SMD/SMT; Reach SVHC Compliant: Yes; IEC Conformance: No; Connector Type: BOARD CONNECTOR; MIL Conformance: No; RoHS Compliant: Yes; PCB Contact Pattern: RECTANGULAR; Flammability Rating: UL94 V-0; Gender: Male; Mating Contact Pitch: 0.05inch; Insulation Material: Polymer; Number of Rows Loaded: 2; Contact Finish - Mating: GOLD (10) OVER NICKEL (50); Mating Contact Row Spacing: 0.05inch; DIN Conformance: No; Pins: 14; Mounting Option 1: LOCKING; Contact Finish - Termination: Tin (Sn) - with Nickel (Ni) barrier; JESD-609 Code: e3; Contact Gender: Male; Mixed Contacts: No; Mounting Technology: Board
R1_MCU = CMP-009-00209-4: Fixed Resistor, Metal Glaze/thick Film, 0.0625W, 620ohm, 50V, 5% +/-Tol, 100ppm/Cel, Surface Mount, 0402; AECQ: No; RoHS Compliant: Yes; Min Operating Temperature: -55°C; Max Operating Temperature: 155°C; Pins: 2; Mounting Technology: Surface Mount
R2_MCU R3_MCU R4_MCU R5_MCU R6_MCU R7_MCU R8_MCU R9_MCU R11_MCU = CMP-009-00184-8: Fixed Resistor, Metal Glaze/thick Film, 0.0625W, 4700ohm, 50V, 5% +/-Tol, 100ppm/Cel, Surface Mount, 0402; Manufacturer Part Number: Blank; Package Height: 0.35mm; Package Length: 1mm; Rated Temperature: 70°C; Package Width: 0.5mm; AECQ: No; Temperature Coefficient (ppm/Cel): 200; Additional Feature: LASER TRIMMABLE; Mounting Technology: Surface Mount; Technology: METAL GLAZE/THICK FILM; RoHS Compliant: Yes; Resistor Type: FIXED RESISTOR; Package Shape: Rectangular; Pins: 2; Construction: Chip; Terminal Finish: Nickel; Max Operating Temperature: 155°C; Working Voltage: 50V; Packaging: Tape and Reel; Termination: Wraparound; JESD-609 Code: e3; Reach SVHC Compliant: Yes; Min Operating Temperature: -55°C
R10_MCU = CMP-009-00225-1: Res Thick Film 0402 330 Ohm 1% 0.063W ±100ppm/°C Molded SMD Paper T/R; AECQ: Yes; Mounting Technology: Surface Mount; Max Operating Temperature: 155°C; RoHS Compliant: Yes; Pins: 2; Min Operating Temperature: -55°C
R13_MCU = CMP-009-00182-8: Fixed Resistor, Metal Glaze/thick Film, 0.0625W, 1000ohm, 50V, 1% +/-Tol, 100ppm/Cel, Surface Mount, 0402; Manufacturer Part Number: Blank; Package Width: 0.5mm; Rated Temperature: 70°C; AECQ: No; Package Length: 1mm; Additional Feature: LASER TRIMMABLE; Package Height: 0.35mm; Temperature Coefficient (ppm/Cel): 100; RoHS Compliant: Yes; Working Voltage: 50V; Min Operating Temperature: -55°C; Pins: 2; Reach SVHC Compliant: Yes; Technology: METAL GLAZE/THICK FILM; Terminal Finish: Nickel; Max Operating Temperature: 155°C; Resistor Type: FIXED RESISTOR; Package Shape: Rectangular; Mounting Technology: Surface Mount; Termination: Wraparound; JESD-609 Code: e3; Packaging: Tape and Reel; Construction: Chip
U1_MCU = CMP-020-00028-1: MCU 32-bit ARM Cortex M7 RISC 512KB Flash 1.8V/2.5V/3.3V 100-Pin LQFP Tray; Frequency: 550MHz; Min Operating Temperature: -40°C; Max Operating Temperature: 85°C; Case/Package: 100-LQFP (14x14); RoHS Compliant: Yes; PartId: 1
Y1_MCU = CMP-003-00031-2: Parallel - Fundamental Quartz Crystal, 0.032768MHz Nom; Frequency: 32.769kHz; Load Capacitance: 7pF; ESR: 80k; Min Operating Temperature: -40°C; Max Operating Temperature: 125°C; Case/Package: 3.2.x1.5; Pins: 2; RoHS Compliant: Yes
Y2_MCU = CMP-003-00030-1: Crystal 25.000 Mhz 12PF SMD; AECQ: Yes; ESR: 50; Frequency: 25MHz; Mounting Technology: SMD; Min Operating Temperature: -40°C; Case/Package: 3.2x2.5; Load Capacitance: 12pF; Pins: 4; Max Operating Temperature: 125°C

## Sheet Power.SchDoc: POWER
size 431 x 279 mm; SheetNumber: 2; SheetTotal: 14; SheetRevision: 1.0
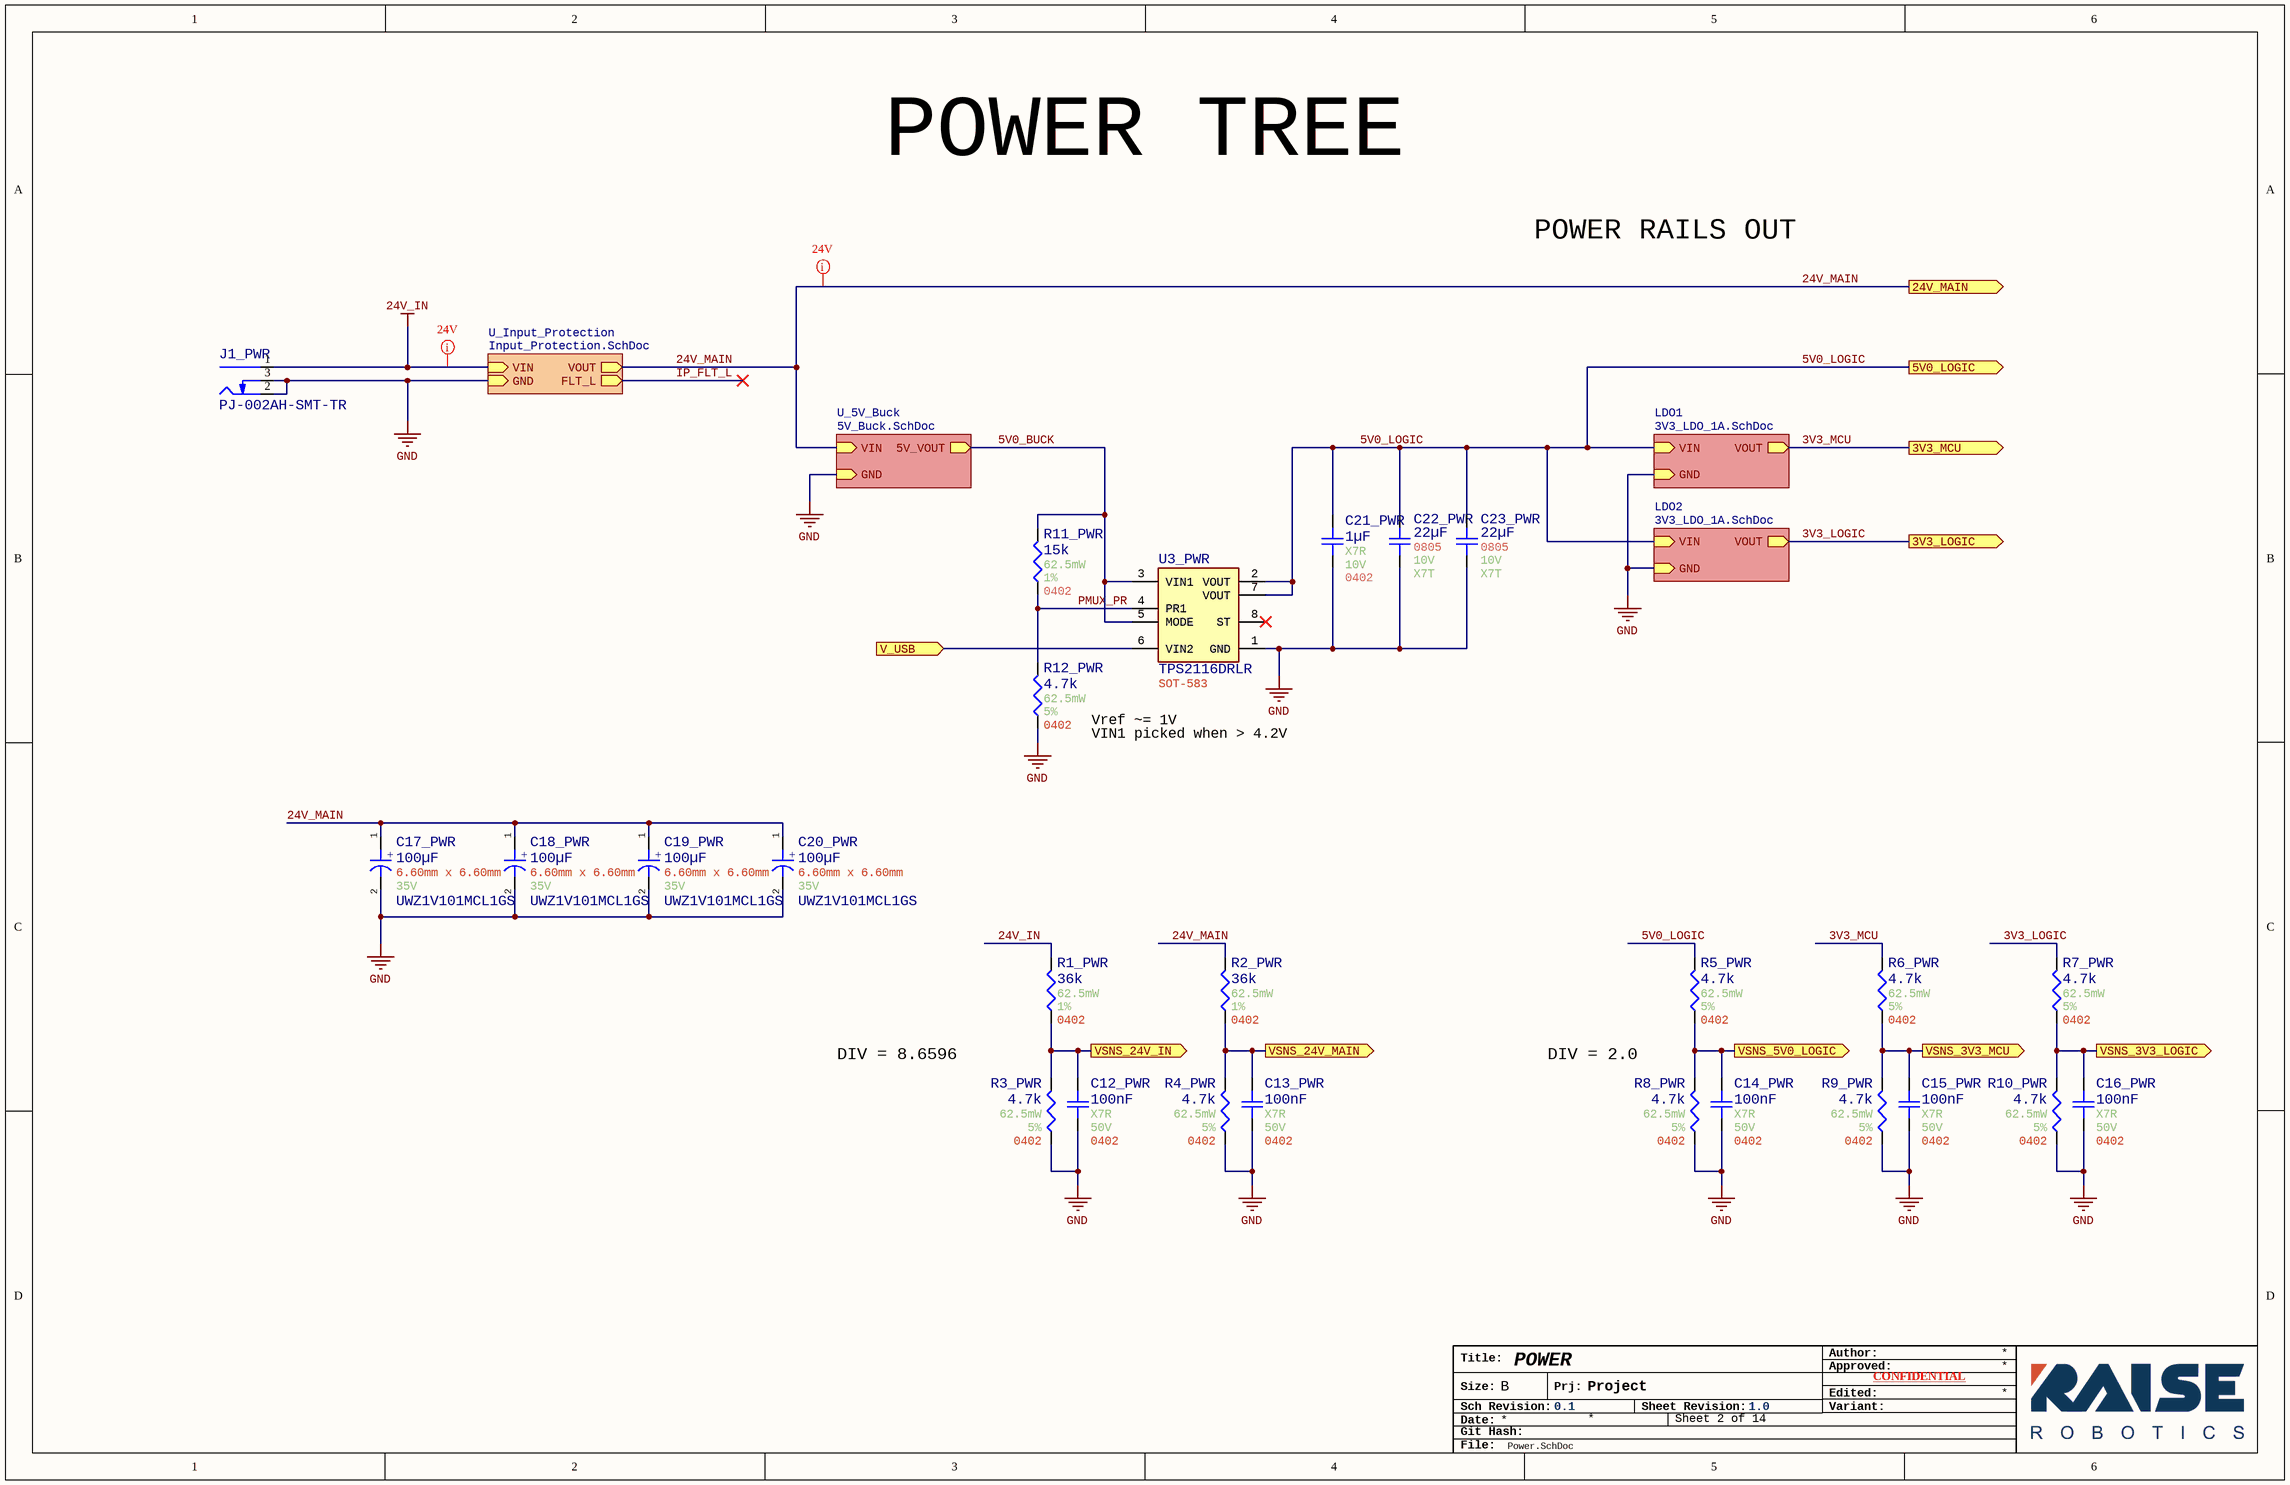
[diagram p2: Power.SchDoc]

### Parts
C12_PWR  value 100nF  Temperature Coefficient: X7R  Voltage Rating: 50V  Case/Package: 0402  [Generic 0402 capacitor]  (hidden comment: GRT155R71H104KE01D)
C13_PWR  value 100nF  Temperature Coefficient: X7R  Voltage Rating: 50V  Case/Package: 0402  [Generic 0402 capacitor]  (hidden comment: GRT155R71H104KE01D)
C14_PWR  value 100nF  Temperature Coefficient: X7R  Voltage Rating: 50V  Case/Package: 0402  [Generic 0402 capacitor]  (hidden comment: GRT155R71H104KE01D)
C15_PWR  value 100nF  Temperature Coefficient: X7R  Voltage Rating: 50V  Case/Package: 0402  [Generic 0402 capacitor]  (hidden comment: GRT155R71H104KE01D)
C16_PWR  value 100nF  Temperature Coefficient: X7R  Voltage Rating: 50V  Case/Package: 0402  [Generic 0402 capacitor]  (hidden comment: GRT155R71H104KE01D)
C17_PWR  UWZ1V101MCL1GS  value 100µF  Case/Package: 6.60mm x 6.60mm  Voltage Rating: 35V  [UWZ1V101MCL1GS]
C18_PWR  UWZ1V101MCL1GS  value 100µF  Case/Package: 6.60mm x 6.60mm  Voltage Rating: 35V  [UWZ1V101MCL1GS]
C19_PWR  UWZ1V101MCL1GS  value 100µF  Case/Package: 6.60mm x 6.60mm  Voltage Rating: 35V  [UWZ1V101MCL1GS]
C20_PWR  UWZ1V101MCL1GS  value 100µF  Case/Package: 6.60mm x 6.60mm  Voltage Rating: 35V  [UWZ1V101MCL1GS]
C21_PWR  value 1µF  Temperature Coefficient: X7R  Voltage Rating: 10V  Case/Package: 0402  [Generic 0402 capacitor]  (hidden comment: MAASL105CD7105MFCA01)
C22_PWR  value 22µF  Temperature Coefficient: X7T  Voltage Rating: 10V  Case/Package: 0805  [Generic 0805 Cap]  (hidden comment: GRT21BD71A226ME13L)
C23_PWR  value 22µF  Temperature Coefficient: X7T  Voltage Rating: 10V  Case/Package: 0805  [Generic 0805 Cap]  (hidden comment: GRT21BD71A226ME13L)
J1_PWR  PJ-002AH-SMT-TR  [CUI PJ-002AH-SMT-TR]
R1_PWR  value 36k  Power: 62.5mW  Tolerance: 1%  Case/Package: 0402  [Generic 0402 Resistor]  (hidden comment: AC0402FR-0736KL)
R2_PWR  value 36k  Power: 62.5mW  Tolerance: 1%  Case/Package: 0402  [Generic 0402 Resistor]  (hidden comment: AC0402FR-0736KL)
R3_PWR  value 4.7k  Power: 62.5mW  Tolerance: 5%  Case/Package: 0402  [Generic 0402 Resistor]  (hidden comment: WR04X472JTL)
R4_PWR  value 4.7k  Power: 62.5mW  Tolerance: 5%  Case/Package: 0402  [Generic 0402 Resistor]  (hidden comment: WR04X472JTL)
R5_PWR  value 4.7k  Power: 62.5mW  Tolerance: 5%  Case/Package: 0402  [Generic 0402 Resistor]  (hidden comment: WR04X472JTL)
R6_PWR  value 4.7k  Power: 62.5mW  Tolerance: 5%  Case/Package: 0402  [Generic 0402 Resistor]  (hidden comment: WR04X472JTL)
R7_PWR  value 4.7k  Power: 62.5mW  Tolerance: 5%  Case/Package: 0402  [Generic 0402 Resistor]  (hidden comment: WR04X472JTL)
R8_PWR  value 4.7k  Power: 62.5mW  Tolerance: 5%  Case/Package: 0402  [Generic 0402 Resistor]  (hidden comment: WR04X472JTL)
R9_PWR  value 4.7k  Power: 62.5mW  Tolerance: 5%  Case/Package: 0402  [Generic 0402 Resistor]  (hidden comment: WR04X472JTL)
R10_PWR  value 4.7k  Power: 62.5mW  Tolerance: 5%  Case/Package: 0402  [Generic 0402 Resistor]  (hidden comment: WR04X472JTL)
R11_PWR  value 15k  Power: 62.5mW  Tolerance: 1%  Case/Package: 0402  [Generic 0402 Resistor]  (hidden comment: AC0402FR-1315KL)
R12_PWR  value 4.7k  Power: 62.5mW  Tolerance: 5%  Case/Package: 0402  [Generic 0402 Resistor]  (hidden comment: WR04X472JTL)
U3_PWR  TPS2116DRLR  Case/Package: SOT-583  [SOT-583_1.3x2.2x0.6mm_P0.5mm]

### Sub-sheets
LDO1 = 3V3_LDO_1A.SchDoc: VIN (in), VOUT (out), GND (in)
LDO2 = 3V3_LDO_1A.SchDoc: VIN (in), VOUT (out), GND (in)
U_5V_Buck = 5V_Buck.SchDoc: VIN (in), 5V_VOUT (out), GND (in)
U_Input_Protection = Input_Protection.SchDoc (file not in this document): VIN (in), VOUT (out), GND (in), FLT_L (out)

### Ports
3V3_LOGIC (out), 3V3_MCU (out), 5V0_LOGIC (out), 24V_MAIN (out), V_USB (in), VSNS_3V3_LOGIC (out), VSNS_3V3_MCU (out), VSNS_5V0_LOGIC (out), VSNS_24V_IN (out), VSNS_24V_MAIN (out)

### Nets
3V3_LOGIC: R7_PWR.2 ; port 3V3_LOGIC, sheet LDO2/VOUT
3V3_MCU: R6_PWR.2 ; port 3V3_MCU, sheet LDO1/VOUT
5V0_LOGIC: C21_PWR.2 C22_PWR.2 C23_PWR.2 R5_PWR.2 U3_PWR.2(VOUT) U3_PWR.7(VOUT) ; port 5V0_LOGIC, sheet LDO1/VIN, sheet LDO2/VIN
5V0_USB: U3_PWR.6(VIN2) ; port V_USB
24V_IN: J1_PWR.1(Centre) R1_PWR.2 ; sheet U_Input_Protection/VIN
24V_MAIN: C17_PWR.1 C18_PWR.1 C19_PWR.1 C20_PWR.1 R2_PWR.2 ; port 24V_MAIN, sheet U_Input_Protection/VOUT, sheet U_5V_Buck/VIN
GND: C12_PWR.2 C13_PWR.2 C14_PWR.2 C15_PWR.2 C16_PWR.2 C17_PWR.2 C18_PWR.2 C19_PWR.2 C20_PWR.2 C21_PWR.1 C22_PWR.1 C23_PWR.1 J1_PWR.2(Outer) J1_PWR.3(SW) R3_PWR.1 R4_PWR.1 R8_PWR.1 R9_PWR.1 R10_PWR.1 R12_PWR.1 U3_PWR.1(GND) ; sheet U_Input_Protection/GND, sheet U_5V_Buck/GND, sheet LDO1/GND, sheet LDO2/GND
5V0_BUCK: R11_PWR.2 U3_PWR.3(VIN1) U3_PWR.5(MODE) ; sheet U_5V_Buck/5V_VOUT
IP_FLT_L: sheet U_Input_Protection/FLT_L
PMUX_PR: R11_PWR.1 R12_PWR.2 U3_PWR.4(PR1)
VSNS_3V3_LOGIC: C16_PWR.1 R7_PWR.1 R10_PWR.2 ; port VSNS_3V3_LOGIC
VSNS_3V3_MCU: C15_PWR.1 R6_PWR.1 R9_PWR.2 ; port VSNS_3V3_MCU
VSNS_5V0_LOGIC: C14_PWR.1 R5_PWR.1 R8_PWR.2 ; port VSNS_5V0_LOGIC
VSNS_24V_IN: C12_PWR.1 R1_PWR.1 R3_PWR.2 ; port VSNS_24V_IN
VSNS_24V_MAIN: C13_PWR.1 R2_PWR.1 R4_PWR.2 ; port VSNS_24V_MAIN

Not connected (* = marked no-connect by the designer): U3_PWR 8(ST)*

### Layout directives
net class HV_24V: 24V_IN, 24V_MAIN

### Notes on the sheet
- POWER TREE
- POWER RAILS OUT
- Vref ~= 1V
- VIN1 picked when > 4.2V
- DIV = 8.6596
- DIV = 2.0
- Title:
- Author:
- Approved:
- Size:
- Date:
- Git Hash:
- Sch Revision:
- B
- Prj:
- Sheet Revision:
- Variant:
- Edited:
- CONFIDENTIAL
- File:
- (in symbol CMP-001-00099-2) +

### Library data of the parts
C12_PWR C13_PWR C14_PWR C15_PWR C16_PWR = CMP-001-00084-12: as C1 on sheet Top; Reach SVHC Compliant: Yes; Mounting Technology: Surface Mount; Termination: Wraparound; Pins: 2; Packaging: Tape and Reel; Package Shape: Rectangular; Multilayer: Yes; Tolerance: 10%; Max Operating Temperature: 125°C; Terminal Finish: Nickel; Capacitor Type: Ceramic; Dielectric Material: Ceramic; Min Operating Temperature: -55°C; RoHS Compliant: Yes
C17_PWR C18_PWR C19_PWR C20_PWR = CMP-001-00099-2: Aluminum Electrolytic Capacitor, Polarized, Aluminum (wet), 35V, 20% +Tol, 20% -Tol, 100uF, Surface Mount, 2626; Capacitor Type: Aluminium; AECQ: Yes; Ripple Current: 84mA; Min Operating Temperature: -55°C; Mounting Technology: Surface Mount; Max Operating Temperature: 105°C; RoHS Compliant: Yes; Pins: 2
C21_PWR = CMP-001-00104-2: Cap Cer 1UF 20V X7T 0402; AECQ: Yes; Capacitor Type: Ceramic; Tolerance: 20%; Min Operating Temperature: -55°C; Max Operating Temperature: 125°C; Pins: 2; RoHS Compliant: Yes; Mounting Technology: Surface Mount
C22_PWR C23_PWR = CMP-001-00095-2: 22 µF ±20% 10V Ceramic Capacitor X7T 0805 (2012 Metric); AECQ: Yes; Mounting Technology: SMD; Tolerance: 20%; Capacitor Type: Ceramic; Min Operating Temperature: -55°C; Pins: 2; Max Operating Temperature: 125°C
J1_PWR = PJ-002AH-SMT-TR: CONN PWR JACK 2X5.5MM SOLDER; Manufacturer: CUI Devices; Actual Diameter: 0.079" (2.00mm ID), 0.256" (6.50mm OD); Current Rating (Amps): 5A; Gender: Male; Industry Recognized Mating Diameter: 2.00mm ID (0.079"), 5.50mm OD (0.217"); Internal Switch(s): Single Switch, Normally Closed; Material Flammability Rating: UL94 V-0; Mating Length/Depth: 0.350" (8.90mm); Number of Positions/Contacts: 2 Conductors, 3 Contacts; Shielding: Unshielded; Voltage - Rated: 24VDC; Part Number: PJ-002AH-SMT-TR; ComponentLink1Description: Datasheet; ComponentLink1URL: https://www.cuidevices.com/product/resource/digikeypdf/pj-002ah-smt-tr.pdf; ComponentLink2Description: DigiKey Link; ComponentLink2URL: http://digikey.com/product-detail/en/cui-devices/PJ-002AH-SMT-TR/CP-002AHPJCT-ND/669692; Connector Type: Jack; Features: Board Guide; LastUpdated: 5/26/2020 1:33:39 PM; Lifecycle Status: Active; Minimum Order: 1; Mounting Type: Surface Mount; Packaging: TapeAndReel; Part Status: Active; Price: 0.90; Series: -; Supplier 1: DigiKey; Supplier Part Number 1: CP-002AHPJCT-ND; Termination: Solder
R1_PWR R2_PWR = CMP-009-00198-3: Fixed Resistor, Metal Glaze/thick Film, 0.0625W, 36000ohm, 50V, 1% +/-Tol, 100ppm/Cel, Surface Mount, 0402; AECQ: Yes; Mounting Technology: SMD; Pins: 2; Max Operating Temperature: 155°C; Min Operating Temperature: -55°C
R3_PWR R4_PWR R8_PWR R9_PWR R10_PWR = CMP-009-00184-8: Fixed Resistor, Metal Glaze/thick Film, 0.0625W, 4700ohm, 50V, 5% +/-Tol, 100ppm/Cel, Surface Mount, 0402; Manufacturer Part Number: Blank; AECQ: No; Package Height: 0.35mm; Package Length: 1mm; Rated Temperature: 70°C; Package Width: 0.5mm; Temperature Coefficient (ppm/Cel): 200; Additional Feature: LASER TRIMMABLE; Pins: 2; Mounting Technology: Surface Mount; Min Operating Temperature: -55°C; RoHS Compliant: Yes; Max Operating Temperature: 155°C; Technology: METAL GLAZE/THICK FILM; Resistor Type: FIXED RESISTOR; Package Shape: Rectangular; Construction: Chip; Terminal Finish: Nickel; Working Voltage: 50V; Packaging: Tape and Reel; Termination: Wraparound; JESD-609 Code: e3; Reach SVHC Compliant: Yes
R5_PWR R6_PWR R7_PWR R12_PWR = CMP-009-00184-8: as R2_MCU on sheet MCU; Mounting Technology: Surface Mount; Technology: METAL GLAZE/THICK FILM; RoHS Compliant: Yes; Resistor Type: FIXED RESISTOR; Package Shape: Rectangular; Pins: 2; Construction: Chip; Terminal Finish: Nickel; Max Operating Temperature: 155°C; Working Voltage: 50V; Packaging: Tape and Reel; Termination: Wraparound; JESD-609 Code: e3; Reach SVHC Compliant: Yes; Min Operating Temperature: -55°C
R11_PWR = CMP-009-00228-2: Res Thick Film 0402 15K Ohm 1% 0.063W(1/16W) ±100ppm/°C Pad SMD T/R Automotive AEC-Q200; AECQ: Yes; Min Operating Temperature: -55°C; Max Operating Temperature: 155°C; Pins: 2; Mounting Technology: SMD
U3_PWR = CMP-031-00020-1: 1.6-V to 5.5-V, 40-mΩ, 2.5-A, low-IQ, priority power multiplexer ; 8-SOT-5X3 -40 to 125; Min Supply Voltage: 1.6V; AECQ: No; Max Supply Voltage: 40V; Mounting Technology: SMT; Min Operating Temperature: -40°C; MPN: TPS2116DRLR; Pins: 8; Max Operating Temperature: 125°C

## Sheet 5V_Buck.SchDoc: 5V_BUCK
size 431 x 279 mm; Author: Shivam Sharma; SheetNumber: 8; SheetTotal: 13; SheetRevision: 1.0
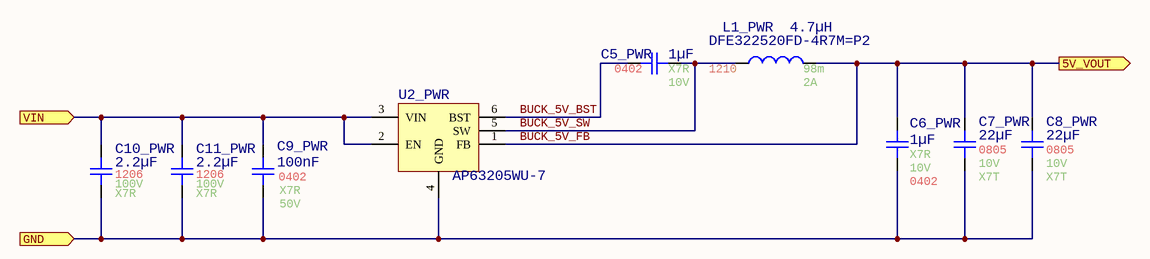
[diagram p3: 5V_Buck.SchDoc]

### Parts
C5_PWR  value 1µF  Temperature Coefficient: X7R  Voltage Rating: 10V  Case/Package: 0402  [Generic 0402 capacitor]  (hidden comment: MAASL105CD7105MFCA01)
C6_PWR  value 1µF  Temperature Coefficient: X7R  Voltage Rating: 10V  Case/Package: 0402  [Generic 0402 capacitor]  (hidden comment: MAASL105CD7105MFCA01)
C7_PWR  value 22µF  Temperature Coefficient: X7T  Voltage Rating: 10V  Case/Package: 0805  [Generic 0805 Cap]  (hidden comment: GRT21BD71A226ME13L)
C8_PWR  value 22µF  Temperature Coefficient: X7T  Voltage Rating: 10V  Case/Package: 0805  [Generic 0805 Cap]  (hidden comment: GRT21BD71A226ME13L)
C9_PWR  value 100nF  Temperature Coefficient: X7R  Voltage Rating: 50V  Case/Package: 0402  [Generic 0402 capacitor]  (hidden comment: GRT155R71H104KE01D)
C10_PWR  value 2.2µF  Temperature Coefficient: X7R  Voltage Rating: 100V  Case/Package: 1206  [Generic 1206 Capacitor]  (hidden comment: 12061C225K4T2A)
C11_PWR  value 2.2µF  Temperature Coefficient: X7R  Voltage Rating: 100V  Case/Package: 1206  [Generic 1206 Capacitor]  (hidden comment: 12061C225K4T2A)
L1_PWR  DFE322520FD-4R7M=P2  value 4.7µH  DCR: 98m  Current Rating: 2A  Case/Package: 1210  [FP-DFE322520F_D-IPC_A]
U2_PWR  AP63205WU-7  [TSOT-26-6 - 3.2mm]

### Ports
5V_VOUT (out), GND (in), VIN (in)

### Nets
24V_MAIN: C9_PWR.1 C10_PWR.2 C11_PWR.2 U2_PWR.2(EN) U2_PWR.3(VIN) ; port VIN
GND: C6_PWR.1 C7_PWR.1 C8_PWR.1 C9_PWR.2 C10_PWR.1 C11_PWR.1 U2_PWR.4(GND) ; port GND
BUCK_5V_BST: C5_PWR.2 U2_PWR.6(BST)
BUCK_5V_FB: C6_PWR.2 C7_PWR.2 C8_PWR.2 L1_PWR.2 U2_PWR.1(FB) ; port 5V_VOUT  [project net 5V0_BUCK]
BUCK_5V_SW: C5_PWR.1 L1_PWR.1 U2_PWR.5(SW)

### Notes on the sheet
- Title:
- Author:
- Approved:
- Size:
- Date:
- Git Hash:
- Sch Revision:
- B
- Prj:
- Sheet Revision:
- Variant:
- Edited:
- CONFIDENTIAL
- File:

### Library data of the parts
C5_PWR C6_PWR = CMP-001-00104-2: as C21_PWR on sheet Power; Min Operating Temperature: -55°C; Max Operating Temperature: 125°C; Pins: 2; RoHS Compliant: Yes; Mounting Technology: Surface Mount
C7_PWR C8_PWR = CMP-001-00095-2: as C22_PWR on sheet Power; Mounting Technology: SMD; Tolerance: 20%; Capacitor Type: Ceramic; Min Operating Temperature: -55°C; Pins: 2; Max Operating Temperature: 125°C
C9_PWR = CMP-001-00084-12: as C1 on sheet Top; Reach SVHC Compliant: Yes; Mounting Technology: Surface Mount; Termination: Wraparound; Pins: 2; Packaging: Tape and Reel; Package Shape: Rectangular; Multilayer: Yes; Tolerance: 10%; Max Operating Temperature: 125°C; Terminal Finish: Nickel; Capacitor Type: Ceramic; Dielectric Material: Ceramic; Min Operating Temperature: -55°C; RoHS Compliant: Yes
C10_PWR C11_PWR = CMP-001-00086-3: Ceramic Capacitor, Multilayer, Ceramic, 100V, 10% +Tol, 10% -Tol, X7R, 15% TC, 2.2uF, Surface Mount, 1206; AECQ: Yes; RoHS Compliant: Yes; Mounting Technology: SMD; Min Operating Temperature: 125°C; Max Operating Temperature: -55°C; Capacitor Type: Ceramic; Tolerance: 10%; Pins: 2
L1_PWR = CMP-006-00022-5: General Purpose Inductor, 4.7uH, 20%, 1 Element, Metal Alloy-Core, SMD, 1210; AECQ: Yes; ComponentLink2Description: https://www.bourns.com/docs/Product-Datasheets/SRP4021HMCT.pdf; Min Operating Temperature: -40°C; Tolerance: 20%; Max Operating Temperature: 125°C; Pins: 2
U2_PWR = AP63205WU-7: 5V fixed step down Buck

## Sheet 3V3_LDO_1A.SchDoc: 3V3_BUCK
size 431 x 279 mm; Author: Shivam Sharma; SheetNumber: 7; SheetTotal: 14; SheetRevision: 1.0
Used 2 times, as channels PWR/LDO1, PWR/LDO2. Parts and nets are listed once, with the designators drawn on the sheet.
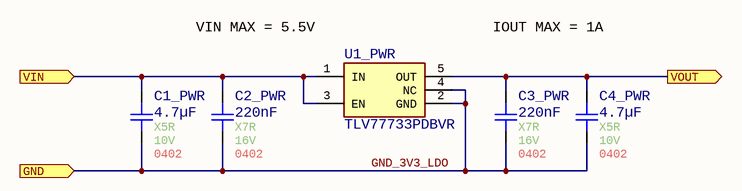
[diagram p4: 3V3_LDO_1A.SchDoc]

### Parts
C1_PWR  value 4.7µF  Temperature Coefficient: X5R  Voltage Rating: 10V  Case/Package: 0402  [Generic 0402 capacitor]  (hidden comment: GRT155R61A475ME13D)
C2_PWR  value 220nF  Temperature Coefficient: X7R  Voltage Rating: 16V  Case/Package: 0402  [Generic 0402 capacitor]  (hidden comment: GCM155R71C224ME02D)
C3_PWR  value 220nF  Temperature Coefficient: X7R  Voltage Rating: 16V  Case/Package: 0402  [Generic 0402 capacitor]  (hidden comment: GCM155R71C224ME02D)
C4_PWR  value 4.7µF  Temperature Coefficient: X5R  Voltage Rating: 10V  Case/Package: 0402  [Generic 0402 capacitor]  (hidden comment: GRT155R61A475ME13D)
U1_PWR  TLV77733PDBVR  [SOT23-3_3x5x1.1mm_P0.95mm]

### Ports
GND (in), VIN (in), VOUT (out)

### Nets
GND_3V3_LDO: C1_PWR.1 C2_PWR.1 C3_PWR.1 C4_PWR.1 U1_PWR.2(GND) U1_PWR.4(NC) ; port GND
VIN: C1_PWR.2 C2_PWR.2 U1_PWR.1(IN) U1_PWR.3(EN) ; port VIN
VOUT: C3_PWR.2 C4_PWR.2 U1_PWR.5(OUT) ; port VOUT

### Channels
PWR/LDO1: designators end in _LDO1; ports GND=GND VIN=5V0_LOGIC VOUT=3V3_MCU
PWR/LDO2: designators end in _LDO2; ports GND=GND VIN=5V0_LOGIC VOUT=3V3_LOGIC

### Notes on the sheet
- VIN MAX = 5.5V
- IOUT MAX = 1A
- Title:
- Author:
- Approved:
- Size:
- Date:
- Git Hash:
- Sch Revision:
- B
- Prj:
- Sheet Revision:
- Variant:
- Edited:
- CONFIDENTIAL
- File:

### Library data of the parts
C1_PWR C4_PWR = CMP-001-00085-5: Ceramic Capacitor, Multilayer, Ceramic, 10V, 20% +Tol, 20% -Tol, X5R, 15% TC, 4.7uF, Surface Mount, 0402; Tolerance: 0%; AECQ: Yes; RoHS Compliant: Yes; Min Operating Temperature: -55°C; Capacitor Type: Ceramic; Tolerance  (fill in as +-): 20%; Termination: Wraparound; Packaging: Tape and Reel; Max Operating Temperature: 85°C; Mounting Technology: Surface Mount; Dielectric Material: Ceramic; Tolerance (fill in as +-): 20%; Pins: 2; Rated DC Voltage (URdc): 10V; Reach SVHC Compliant: Yes; Package Shape: Rectangular; Multilayer: Yes
C2_PWR C3_PWR = CMP-001-00103-2: Ceramic Capacitor, Multilayer, Ceramic, 16V, 20% +Tol, 20% -Tol, X7R, 15% TC, 0.22uF, Surface Mount, 0402; AECQ: Yes; Max Operating Temperature: 125°C; Min Operating Temperature: -55°C; Mounting Technology: SMD; Pins: 2; Capacitor Type: Ceramic; Tolerance: 20%
U1_PWR = CMP-019-00069-1: 1A small-size high-PSRR low-dropout (LDO) regulator with enable 5-SOT-23 -40 to 125; Max Supply Voltage: 5.5V; Nominal Supply Current: 141µA; Min Supply Voltage: 1.45V; Output Voltage: 3.3V; Dropout Voltage: 585mV; Case/Package: SOT-23-5; Pins: 5; Min Operating Temperature: -40°C; Max Operating Temperature: 125°C; RoHS Compliant: Yes; Mounting Technology: SMD; Output Current: 1A

## Sheet CAN_PHY.SchDoc: CAN PHY
size 431 x 279 mm; Author: Shivam Sharma; SheetNumber: 3; SheetTotal: 14; SheetRevision: 1.0
Used 2 times, as channels CAN0, CAN1. Parts and nets are listed once, with the designators drawn on the sheet.
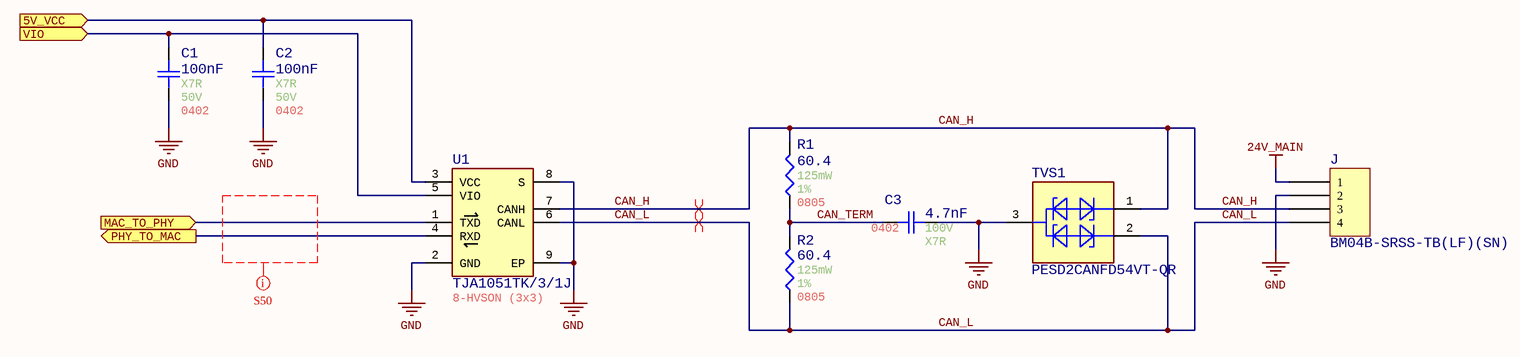
[diagram p5: CAN_PHY.SchDoc]

### Parts
C1  value 100nF  Temperature Coefficient: X7R  Voltage Rating: 50V  Case/Package: 0402  [Generic 0402 capacitor]  (hidden comment: GRT155R71H104KE01D)
C2  value 100nF  Temperature Coefficient: X7R  Voltage Rating: 50V  Case/Package: 0402  [Generic 0402 capacitor]  (hidden comment: GRT155R71H104KE01D)
C3  value 4.7nF  Temperature Coefficient: X7R  Voltage Rating: 100V  Case/Package: 0402  [Generic 0402 capacitor]  (hidden comment: GCM155R72A472KA37D)
J  BM04B-SRSS-TB(LF)(SN)  [JST BM04B-SRSS-TB]
R1  value 60.4  Power: 125mW  Tolerance: 1%  Case/Package: 0805  [0805 Resistor]  (hidden comment: TFA0805R60R4F-T5)
R2  value 60.4  Power: 125mW  Tolerance: 1%  Case/Package: 0805  [0805 Resistor]  (hidden comment: TFA0805R60R4F-T5)
TVS1  PESD2CANFD54VT-QR  [PESD2CANFD54VT-QR]
U1  TJA1051TK/3/1J  Case/Package: 8-HVSON (3x3)  [TJA1044xxK]

### Ports
5V_VCC (in), MAC_TO_PHY (in), PHY_TO_MAC (out), VIO (in)

### Nets
24V_MAIN: J.1
GND: C1.2 C2.2 C3.1 J.2 TVS1.3(CC) U1.2(GND) U1.8(S) U1.9(EP)
5V_VCC: C2.1 U1.3(VCC) ; port 5V_VCC
CAN_H: J.3 R1.2 TVS1.1(K1) U1.7(CANH)
CAN_L: J.4 R2.1 TVS1.2(K2) U1.6(CANL)
CAN_TERM: C3.2 R1.1 R2.2
MAC_TO_PHY: U1.1(TXD) ; port MAC_TO_PHY
PHY_TO_MAC: U1.4(RXD) ; port PHY_TO_MAC
VIO: C1.1 U1.5(VIO) ; port VIO

### Channels
CAN0: designators end in _CAN0; ports 5V_VCC=5V0_LOGIC MAC_TO_PHY=CAN0_MCU_TO_PHY_DATA PHY_TO_MAC=CAN0_PHY_TO_MCU_DATA VIO=3V3_LOGIC
CAN1: designators end in _CAN1; ports 5V_VCC=5V0_LOGIC MAC_TO_PHY=CAN1_MCU_TO_PHY_DATA PHY_TO_MAC=CAN1_PHY_TO_MCU_DATA VIO=3V3_LOGIC

### Layout directives
differential pair; differential pair class CAN: CAN_H_CAN0, CAN_L_CAN0
net class S50: (no net found under the mark)

### Notes on the sheet
- Title:
- Author:
- Approved:
- Size:
- Date:
- Git Hash:
- Sch Revision:
- B
- Prj:
- Sheet Revision:
- Variant:
- Edited:
- CONFIDENTIAL
- File:

### Library data of the parts
C1 C2 = CMP-001-00084-12: as C1 on sheet Top; RoHS Compliant: Yes; Package Shape: Rectangular; Max Operating Temperature: 125°C; Terminal Finish: Nickel; Multilayer: Yes; Dielectric Material: Ceramic; Mounting Technology: Surface Mount; Termination: Wraparound; Reach SVHC Compliant: Yes; Min Operating Temperature: -55°C; Tolerance: 10%; Packaging: Tape and Reel; Pins: 2; Capacitor Type: Ceramic
C3 = CMP-001-00110-2: Ceramic Capacitor, Multilayer, Ceramic, 100V, 10% +Tol, 10% -Tol, X7R, 15% TC, 0.0047uF, Surface Mount, 0402; AECQ: Yes; Min Operating Temperature: -55°C; Mounting Technology: SMD; Tolerance: 10%; Max Operating Temperature: 125°C; RoHS Compliant: Yes; Pins: 2; Capacitor Type: Ceramic
J = BM04B-SRSS-TB(LF)(SN): as J1_I2C on sheet Top; Part Number: BM04B-SRSS-TB(LF)(SN); ComponentLink1Description: Datasheet; ComponentLink1URL: http://www.jst-mfg.com/product/pdf/eng/eSH.pdf; ComponentLink2Description: DigiKey Link; ComponentLink2URL: http://digikey.com/product-detail/en/jst-sales-america-inc/BM04B-SRSS-TB-LF-SN/455-1790-1-ND/926861; Connector Type: Header; Contact Finish - Mating: Tin; Contact Finish - Post: Tin; Contact Material: Copper Alloy; Contact Shape: Square; Contact Type: Male Pin; Fastening Type: Push-Pull; Features: Solder Retention; Insulation Color: Natural; Insulation Height: 0.167" (4.25mm); Insulation Material: Polyamide (PA), Nylon; LastUpdated: 8/24/2020 1:45:53 PM; Lifecycle Status: Active; Minimum Order: 1; Mounting Type: Surface Mount; Number of Rows: 1; Operating Temperature: -25°C ~ 85°C; Packaging: TapeAndReel; PartId: 16; Part Status: Active; Price: 0.29; Series: SR; Supplier 1: DigiKey; Supplier Part Number 1: 455-1790-1-ND; Termination: Solder
R1 R2 = CMP-009-00189-2: Res 60.4 Ohm 1% 1/8W 0805; AECQ: Yes; Manufacturer Part Number: TFA0805R60R4F-T5; Mounting Technology: SMD; Pins: 2
TVS1 = CMP-004-00032-1: ESD protection for in-vehicle networks; AECQ: Yes; Pins: 3; Case/Package: TO-236AB
U1 = CMP-031-00007-4: Interface Circuit, PDSO8; AECQ: Yes; Max Operating Temperature: 150°C; Pins: 8; Min Operating Temperature: -40°C; MPN: TJA1051TK/3/1J